# Altium project PROC154E3_SCH.PrjPcb (part 49 of 60)

## Sheet 52. POWER SUPPLY #3.SchDoc: POWER SUPPLY #3
size 513 x 386 mm; Project: PROC154E2(001)_SK_AM69; Issue: 1.0; RevCode: E3; Page Create Date: March  8, 1995; Variant Name: Core Design; Schematic Page Number: 52; Page Number: 52; Page Size: C; Comment: MISTRAL_TITLEBLK_CSIZE_1; Page Count: 62; Schematic Page Count: 62; Name: PROC154E2 001 SK AM69; DsnPath: C:\Users\danie\Downloads\sprr466c\PROC154E3_RP\PROC154E3_SCH.DSN; SchematicName: SCHEMATIC1; PageName: 52. POWER SUPPLY #3; PageSize: C; TopSchematic: True
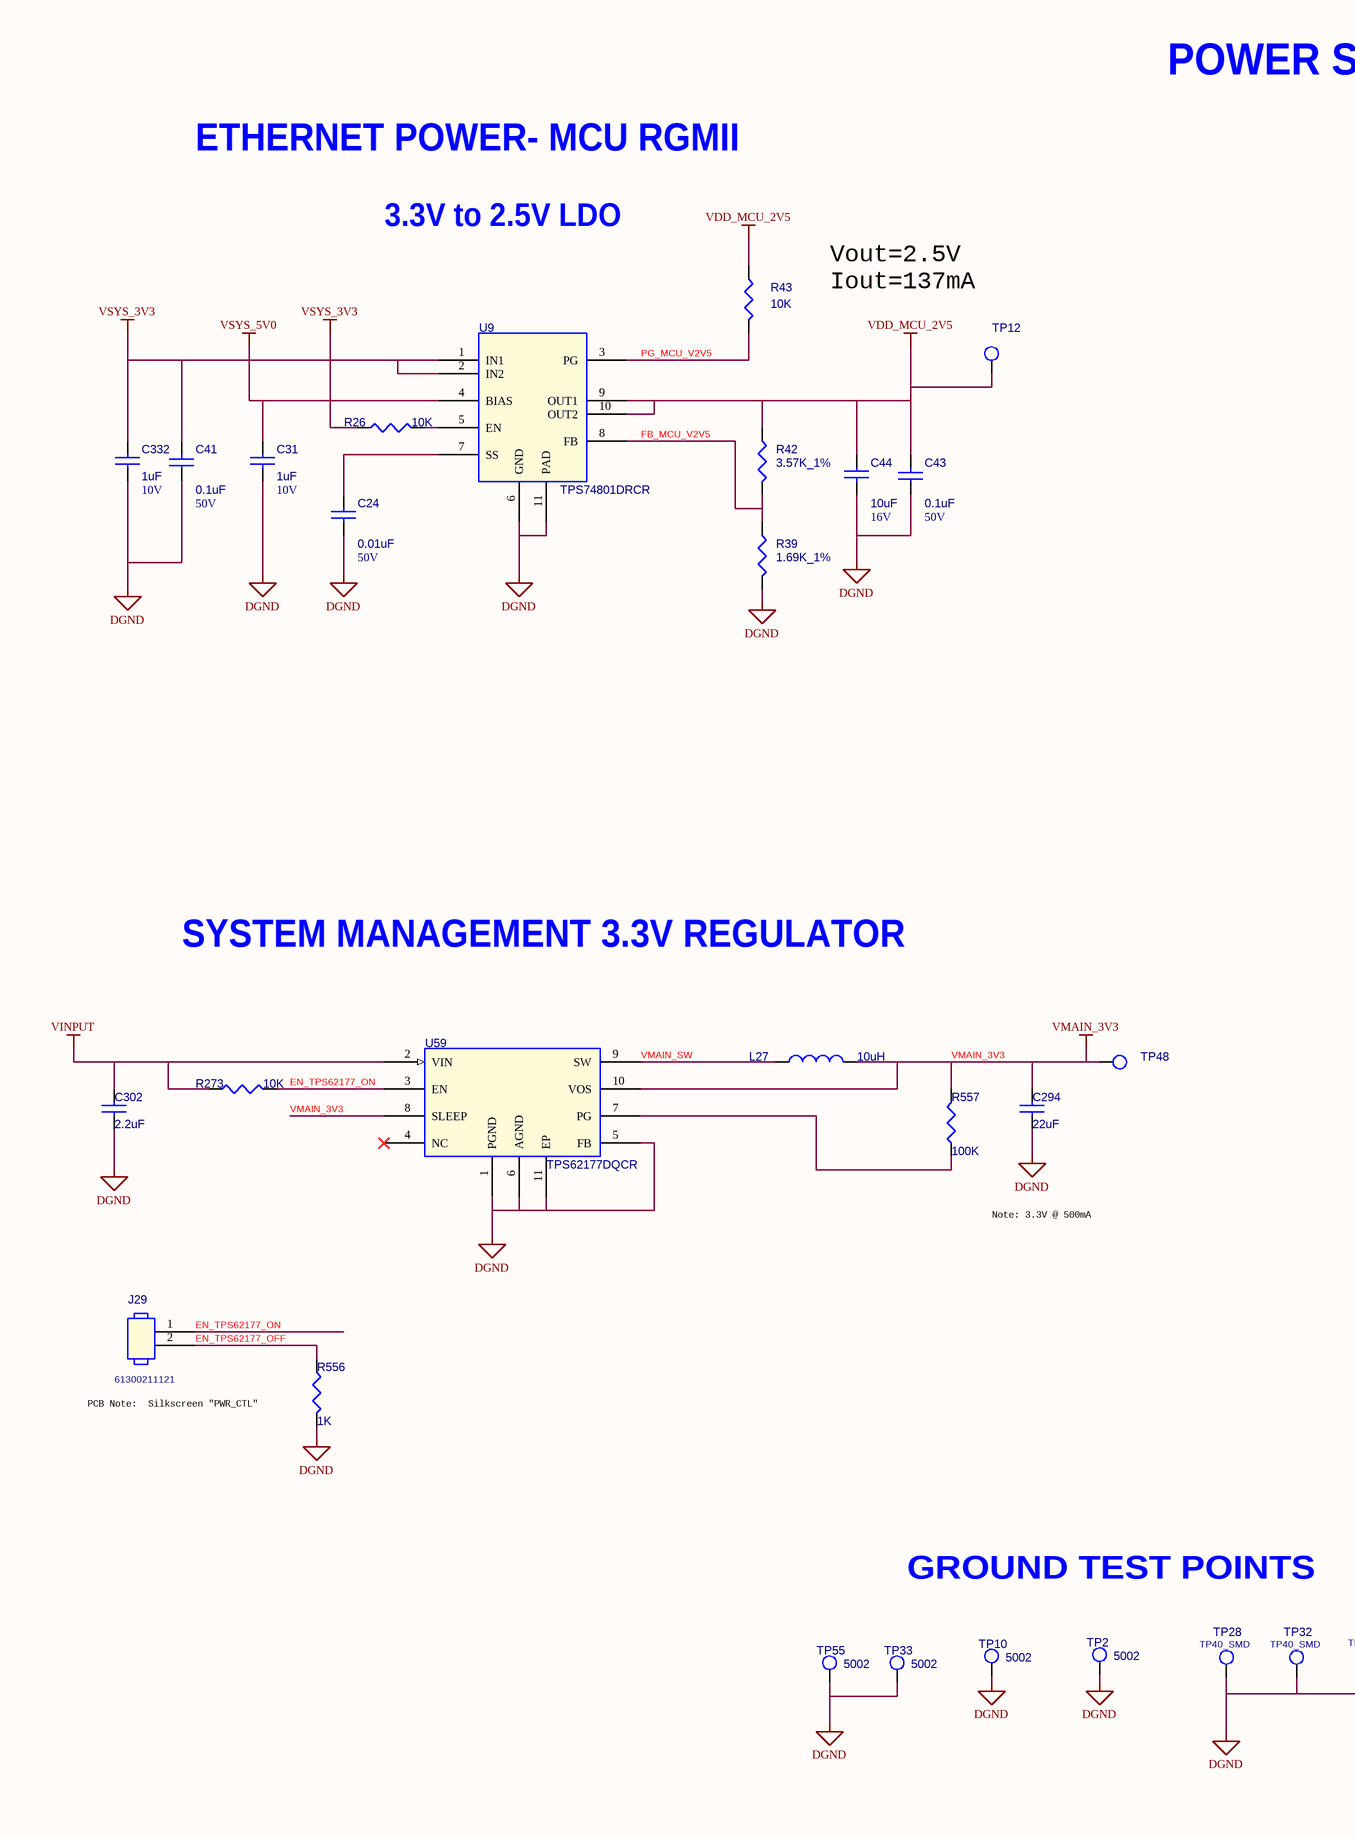
[diagram p87: 52. POWER SUPPLY #3.SchDoc, left]
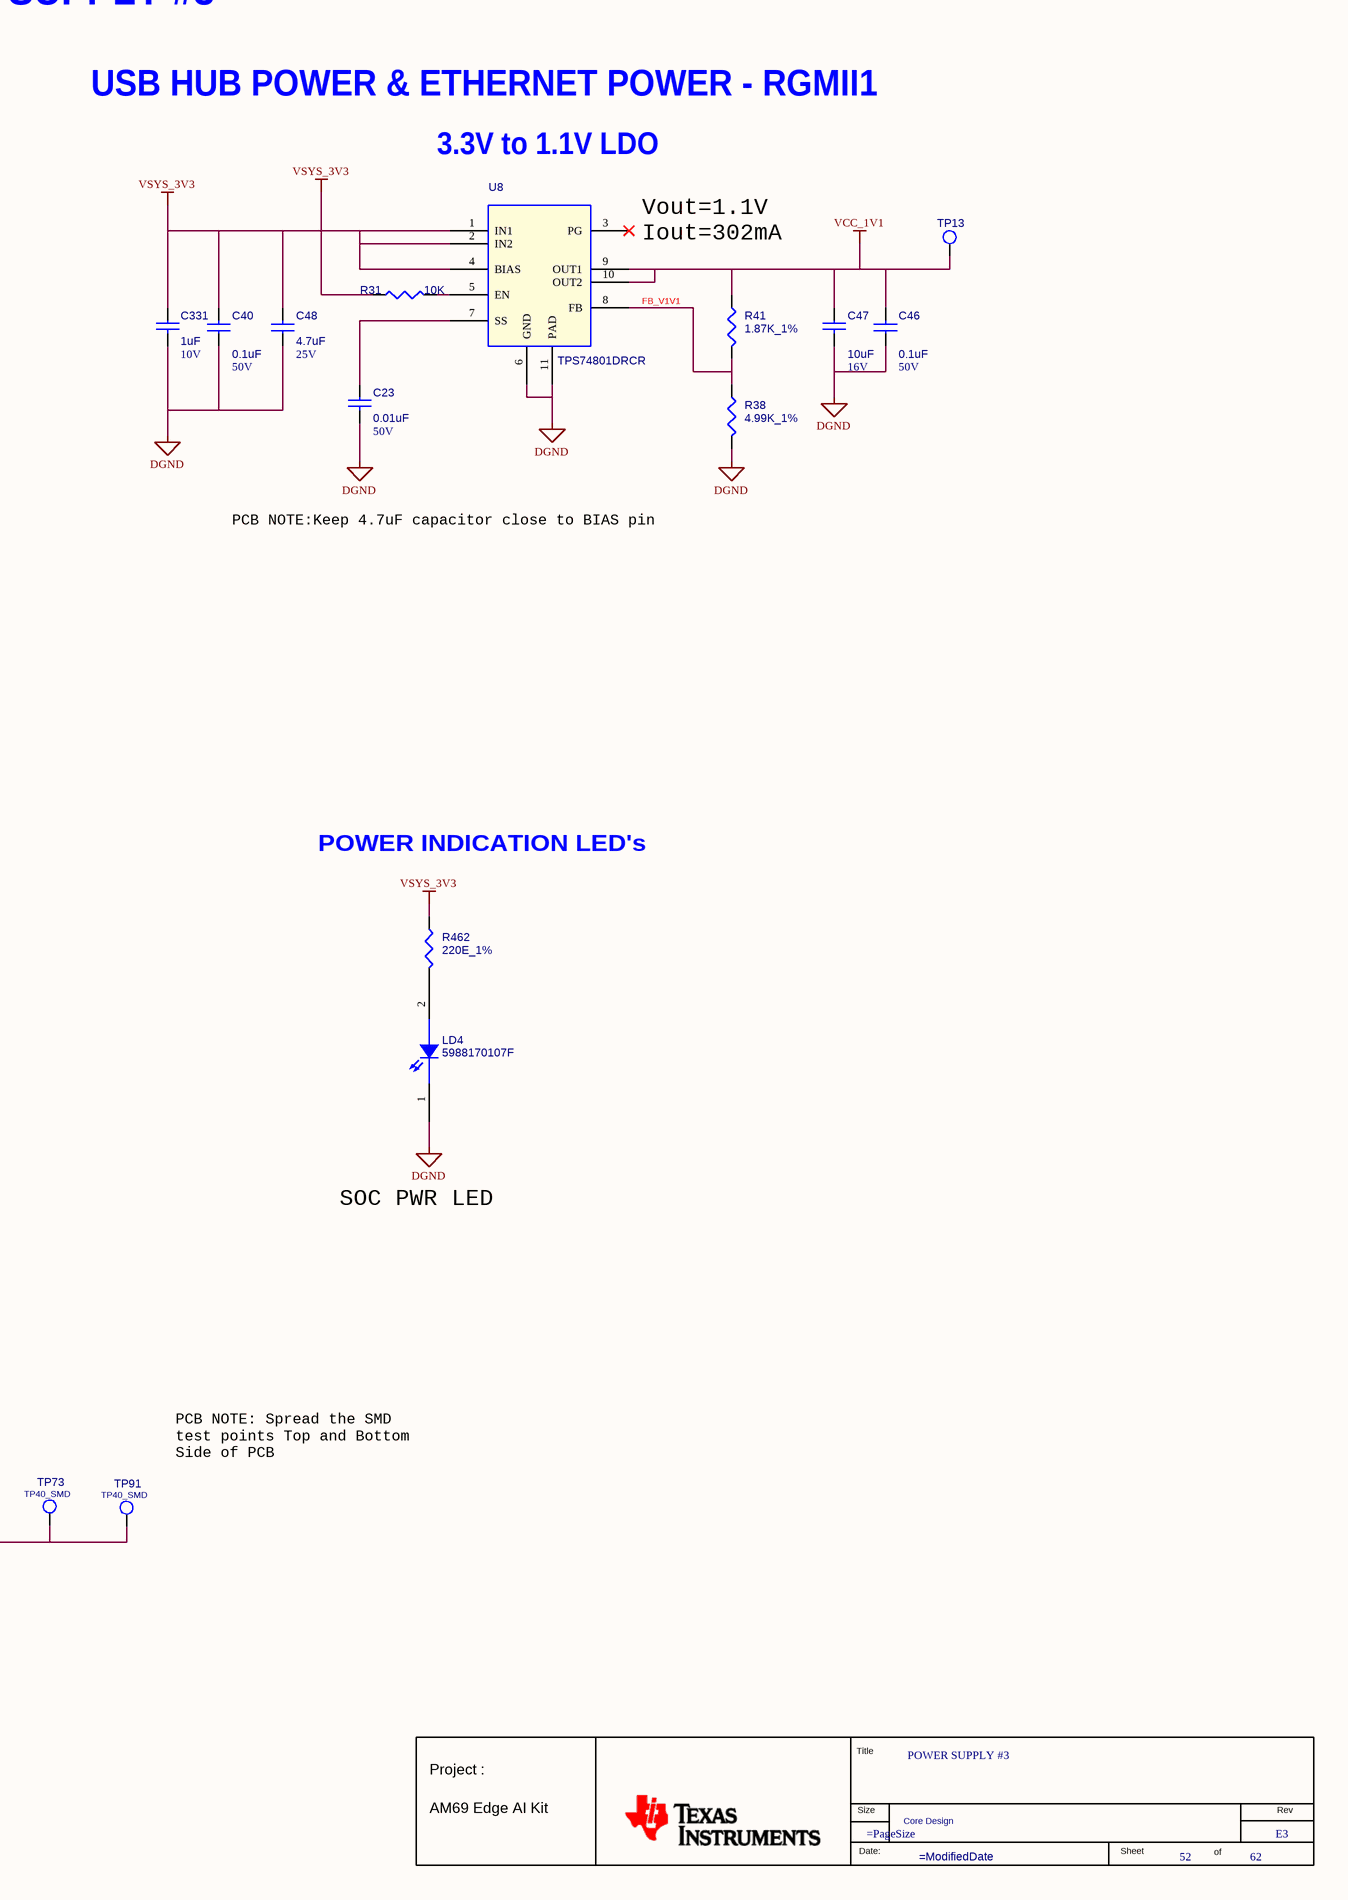
[diagram p88: 52. POWER SUPPLY #3.SchDoc, right]

### Parts
(Parts that share a designator on the sheet are numbered #1, #2 ... from top to bottom, then left to right.)
*#52  RevCode: E3  Title: POWER SUPPLY #3  Page Number: 52  Page Count: 62  Variant Name: Core Design  (hidden comment: MISTRAL_TITLEBLK_CSIZE_1)  (graphical)
C23  0.01uF  Voltage: 50V  [CAP0402_0-75]
C24  0.01uF  Voltage: 50V  [CAP0402_0-75]
C31  1uF  Voltage: 10V  [CAP0402_0-75]
C40  0.1uF  Voltage: 50V  [CAP0402_0-75]
C41  0.1uF  Voltage: 50V  [CAP0402_0-75]
C43  0.1uF  Voltage: 50V  [CAP0402_0-75]
C44  10uF  Voltage: 16V  [CAP0805_1-5]
C46  0.1uF  Voltage: 50V  [CAP0402_0-75]
C47  10uF  Voltage: 16V  [CAP0805_1-5]
C48  4.7uF  Voltage: 25V  [CAP0603_1]
C294  22uF  [CAP0805_1-5]
C302  2.2uF  [CAP0805_1-5]
C331  1uF  Voltage: 10V  [CAP0402_0-75]
C332  1uF  Voltage: 10V  [CAP0402_0-75]
J29  Mfr_part_number: 61300211121  [HDR_1X2_61300211121_S_T_8-6]  (hidden comment: HDR_1X2)
L27  10uH  [IND_1277AS-H_130X110_SMD_1-2]
LD4  5988170107F  [LED_0805_0-7]
R26  10K  [RES0402_0-5]
R31  10K  [RES0402_0-5]
R38  4.99K_1%  [RES0402_0-5]
R39  1.69K_1%  [RES0402_0-5]
R41  1.87K_1%  [RES0402_0-5]
R42  3.57K_1%  [RES0402_0-5]
R43  10K  [RES0402_0-5]
R273  10K  [RES0402_0-5]
R462  220E_1%  [RES0402_0-5]
R556  1K  [RES0201_0-5]
R557  100K  [RES0402_0-5]
TP2  5002  [TP_CIR67D40_TH_4-6]
TP10  5002  [TP_CIR67D40_TH_4-6]
TP12  TP40_SMD  [TP40_SMD]  (value not drawn)
TP13  THRU HOLE  [TP_40X65]  (value not drawn)
TP28  TP40_SMD  [TP40_SMD]
TP32  TP40_SMD  [TP40_SMD]
TP33  5002  [TP_CIR67D40_TH_4-6]
TP48  TP30_SMD  [TP30_SMD]  (value not drawn)
TP55  5002  [TP_CIR67D40_TH_4-6]
TP73  TP40_SMD  [TP40_SMD]
TP91  TP40_SMD  [TP40_SMD]
U8  TPS74801DRCR  [VSON10_TPS74801-Q1_120X120_1]
U9  TPS74801DRCR  [VSON10_TPS74801-Q1_120X120_1]
U59  TPS62177DQCR  [WSON10_19-68_80X120_0-8]

### Nets
DGND: C23.2 C24.2 C31.2 C40.1 C41.1 C43.1 C44.2 C46.1 C47.2 C48.1 C294.2 C302.2 C331.2 C332.2 LD4.1 R38.2 R39.2 R556.2 TP2.1(TP) TP10.1(TP) TP28.1(TP) TP32.1(TP) TP33.1(TP) TP55.1(TP) TP73.1(TP) TP91.1(TP) U8.6(GND) U8.11(PAD) U9.6(GND) U9.11(PAD) U59.1(PGND) U59.5(FB) U59.6(AGND) U59.11(EP)  [project net VDD_CPU_HCPS_GOSNS]
VCC_1V1: C46.2 C47.1 R41.1 TP13.1(TP) U8.9(OUT1) U8.10(OUT2)
VDD_MCU_2V5: C43.2 C44.1 R42.1 R43.1 TP12.1(TP) U9.9(OUT1) U9.10(OUT2)
VINPUT: C302.1 R273.1 U59.2(VIN)
VMAIN_3V3: C294.1 L27.2 R557.2 TP48.1(TP) U59.8(SLEEP) U59.10(VOS)
VSYS_3V3: C40.2 C41.2 C48.2 C331.1 C332.1 R26.1 R31.1 R462.1 U8.1(IN1) U8.2(IN2) U8.4(BIAS) U9.1(IN1) U9.2(IN2)  [project net V_3V3]
VSYS_5V0: C31.1 U9.4(BIAS)
EN_TPS62177_OFF: J29.2 R556.1
EN_TPS62177_ON: J29.1 R273.2 U59.3(EN)
FB_MCU_V2V5: R39.1 R42.2 U9.8(FB)
FB_V1V1: R38.1 R41.2 U8.8(FB)
PG_MCU_V2V5: R43.2 U9.3(PG)
VMAIN_SW: L27.1 U59.9(SW)
NetC23_1: C23.1 U8.7(SS)
NetC24_1: C24.1 U9.7(SS)
NetLD4_2: LD4.2 R462.2
NetR26_2: R26.2 U9.5(EN)
NetR31_2: R31.2 U8.5(EN)
NetR557_1: R557.1 U59.7(PG)

Not connected (* = marked no-connect by the designer): U8 3(PG)*; U59 4(NC)*

### Notes on the sheet
- POWER SUPPLY #3
- ETHERNET POWER- MCU RGMII
- USB HUB POWER & ETHERNET POWER - RGMII1
- 3.3V to 2.5V LDO
- Vout=2.5V
  Iout=137mA
- 3.3V to 1.1V LDO
- Vout=1.1V
  Iout=302mA
- PCB NOTE:Keep 4.7uF capacitor close to BIAS pin
- SYSTEM MANAGEMENT 3.3V REGULATOR
- POWER INDICATION LED's
- Note: 3.3V @ 500mA
- SOC PWR LED
- PCB Note:  Silkscreen "PWR_CTL"
- GROUND TEST POINTS
- PCB NOTE: Spread the SMD
  test points Top and Bottom
  Side of PCB
- (in symbol MISTRAL_TITLEBLK_CSIZE_1) Title; Project :; Size; Rev; AM69 Edge AI Kit; Date:; Sheet; of

### Library data of the parts
*#52 = MISTRAL_TITLEBLK_CSIZE_1: as *#51 on sheet 51. POWER SUPPLY #2; Page Create Date: March  8, 1995; Page Size: =PageSize; Page Modify Date: =ModifiedDate; Schematic Page Count: 62; Schematic Page Number: 52
C23 = CAP_Dup1: CAP CERAMIC 0.01uF 50V 10% X7R 0402; Part Reference: C23; Mistral Part No: 120009030025-R; Mfr_name: MURATA; Mfr_part_number: GRM155R71H103KA88D; Part_type: CAPACITORS\CERAMIC; Direct Alternate_mfr_name: YAGEO AMERICA; Direct Alternate_mfr_part_number: CC0402KRX7R8BB103; Automotive Alternate_mfr_name: TDK; Automotive Alternate_mfr_part_number: CGA2B2X7R1E103K050BA; Project: G4_SVGA; Customs_HS_Code: 85322990; Custom_Duty: 15%; Wattage: NA; Value: 0.01uF; PCB Footprint: CAP0402_0-75; Library Ref: CAP; Tolerance: 10%; Package: 0402; Distributor_name: DIGIKEY; Distributor_part_number: 490-4516-1-ND; Height: 0.55MM; Crtd /date: MANIRAJA/280319; Chkd/date: MANIRAJA/280319; Footprint Ref: CAP0402_0-75; Weight: 0.65mg; Temperature: -55°C+125°C; Datasheet: Y:\MIS_DATABASE\DATASHEETS\CAPACITORS\GRM155R71H103KA88D.PDF; MECHANICAL 3D STEP FILE: CAP0402_0-75; Library Path: Y:\MIS_DATABASE\Library\ALTIUM_TOOL\SCHEMATICS_PARTS\MS_DISCRETE_Library.schlib; Footprint Path: Y:\MIS_DATABASE\Library\ALTIUM_TOOL\PCB_FOOTPRINTS\Altium_Footprint_Lib.PcbLib; Manufacturer: MURATA
C24 = CAP_Dup1: CAP CERAMIC 0.01uF 50V 10% X7R 0402; Part Reference: C24; Part_type: CAPACITORS\CERAMIC; Mfr_part_number: GRM155R71H103KA88D; Mfr_name: MURATA; Mistral Part No: 120009030025-R; Direct Alternate_mfr_name: YAGEO AMERICA; Direct Alternate_mfr_part_number: CC0402KRX7R8BB103; Automotive Alternate_mfr_name: TDK; Automotive Alternate_mfr_part_number: CGA2B2X7R1E103K050BA; Custom_Duty: 15%; Customs_HS_Code: 85322990; Project: G4_SVGA; Wattage: NA; Value: 0.01uF; Chkd/date: MANIRAJA/280319; Crtd /date: MANIRAJA/280319; Height: 0.55MM; Distributor_part_number: 490-4516-1-ND; Distributor_name: DIGIKEY; Package: 0402; Tolerance: 10%; Library Ref: CAP; Footprint Ref: CAP0402_0-75; Weight: 0.65mg; Temperature: -55°C+125°C; Datasheet: Y:\MIS_DATABASE\DATASHEETS\CAPACITORS\GRM155R71H103KA88D.PDF; MECHANICAL 3D STEP FILE: CAP0402_0-75; Library Path: Y:\MIS_DATABASE\Library\ALTIUM_TOOL\SCHEMATICS_PARTS\MS_DISCRETE_Library.schlib; Footprint Path: Y:\MIS_DATABASE\Library\ALTIUM_TOOL\PCB_FOOTPRINTS\Altium_Footprint_Lib.PcbLib; Manufacturer: MURATA; PCB Footprint: CAP0402_0-75
C31 = CAP_Dup1: CAP CERAMIC 1uF 10V 10% X7S AUTO 0402; Part Reference: C31; Automotive Alternate_mfr_part_number: EMK105BJ105KVHF; Automotive Alternate_mfr_name: TAIYO YUDEN; Direct Alternate_mfr_part_number: CC0402KRX5R7BB105; Direct Alternate_mfr_name: YAGEO AMERICA; Mistral Part No: 120018090021-R; Mfr_name: MURATA; Mfr_part_number: GCM155C71A105KE38D; Part_type: CAPACITORS\CERAMIC; Manufacturer: TDK CORPORATION; Project: SMART-M_SCRIPTALK_PB; Wattage: NA; Customs_HS_Code: 85322990; Custom_Duty: 15%; Value: 1uF; Tolerance: 10%; Package: 0402; Distributor_name: DIGIKEY; Distributor_part_number: 490-13409-1-ND; Height: 0.70MM; Weight: 6mg; Temperature: -55°C+125°C; Datasheet: Y:\MIS_DATABASE\DATASHEETS\CAPACITORS\MURATA-GCM-SER.PDF; Crtd /date: ALVY/100918; Chkd/date: MANIRAJA/100918; Library Ref: CAP; MECHANICAL 3D STEP FILE: CAP0402_0-75; Footprint Ref: CAP0402_0-75; Library Path: Y:\MIS_DATABASE\Library\ALTIUM_TOOL\SCHEMATICS_PARTS\MS_DISCRETE_Library.schlib; Footprint Path: Y:\MIS_DATABASE\Library\ALTIUM_TOOL\PCB_FOOTPRINTS\Altium_Footprint_Lib.PcbLib; PCB Footprint: CAP0402_0-75
C40 = CAP_Dup1: CAP CERAMIC 0.1uF 50V 10% X7R 0402; Part Reference: C40; Mistral Part No: 120011100014-R; Mfr_name: MURATA; Mfr_part_number: GRM155R71H104KE14D; Part_type: CAPACITORS\CERAMIC; Direct Alternate_mfr_name: TDK; Direct Alternate_mfr_part_number: C1005X7R1H104K050BE; Automotive Alternate_mfr_part_number: CGA2B3X7R1H104K050BB; Project: J7_CP; Wattage: NA; Customs_HS_Code: 85322990; Custom_Duty: 15%; Value: 0.1uF; PCB Footprint: CAP0402_0-75; Footprint Ref: CAP0402_0-75; Library Ref: CAP; Tolerance: 10%; Package: 0402; Distributor_name: DIGIKEY; Distributor_part_number: 490-10700-1-ND; Height: 0.55MM; Weight: 3.1mg; Temperature: -55°C+125°C; Datasheet: Y:\MIS_DATABASE\DATASHEETS\CAPACITORS\GRM155R71H104KE14.PDF; Crtd /date: ALVY/211020; Chkd/date: MANIRAJA/261020; MECHANICAL 3D STEP FILE: CAP0402_0-75; Library Path: Y:\MIS_DATABASE\Library\ALTIUM_TOOL\SCHEMATICS_PARTS\MS_DISCRETE_Library.schlib; Footprint Path: Y:\MIS_DATABASE\Library\ALTIUM_TOOL\PCB_FOOTPRINTS\Altium_Footprint_Lib.PcbLib; Automotive Alternate_mfr_name: TDK; Manufacturer: MURATA
C41 = CAP_Dup1: CAP CERAMIC 0.1uF 50V 10% X7R 0402; Part Reference: C41; Automotive Alternate_mfr_part_number: CGA2B3X7R1H104K050BB; Automotive Alternate_mfr_name: TDK; Direct Alternate_mfr_part_number: C1005X7R1H104K050BE; Part_type: CAPACITORS\CERAMIC; Mfr_part_number: GRM155R71H104KE14D; Mfr_name: MURATA; Mistral Part No: 120011100014-R; Custom_Duty: 15%; Customs_HS_Code: 85322990; Wattage: NA; Project: J7_CP; Value: 0.1uF; Direct Alternate_mfr_name: TDK; Footprint Path: Y:\MIS_DATABASE\Library\ALTIUM_TOOL\PCB_FOOTPRINTS\Altium_Footprint_Lib.PcbLib; Library Path: Y:\MIS_DATABASE\Library\ALTIUM_TOOL\SCHEMATICS_PARTS\MS_DISCRETE_Library.schlib; MECHANICAL 3D STEP FILE: CAP0402_0-75; Chkd/date: MANIRAJA/261020; Crtd /date: ALVY/211020; Datasheet: Y:\MIS_DATABASE\DATASHEETS\CAPACITORS\GRM155R71H104KE14.PDF; Temperature: -55°C+125°C; Weight: 3.1mg; Height: 0.55MM; Distributor_part_number: 490-10700-1-ND; Distributor_name: DIGIKEY; Package: 0402; Tolerance: 10%; Library Ref: CAP; Footprint Ref: CAP0402_0-75; Manufacturer: MURATA; PCB Footprint: CAP0402_0-75
C43 = CAP_Dup1: CAP CERAMIC 0.1uF 50V 10% X7R 0402; Part Reference: C43; Part_type: CAPACITORS\CERAMIC; Mfr_part_number: GRM155R71H104KE14D; Mfr_name: MURATA; Mistral Part No: 120011100014-R; Direct Alternate_mfr_name: TDK; Direct Alternate_mfr_part_number: C1005X7R1H104K050BE; Automotive Alternate_mfr_part_number: CGA2B3X7R1H104K050BB; Custom_Duty: 15%; Customs_HS_Code: 85322990; Wattage: NA; Project: J7_CP; Value: 0.1uF; Footprint Path: Y:\MIS_DATABASE\Library\ALTIUM_TOOL\PCB_FOOTPRINTS\Altium_Footprint_Lib.PcbLib; Library Path: Y:\MIS_DATABASE\Library\ALTIUM_TOOL\SCHEMATICS_PARTS\MS_DISCRETE_Library.schlib; MECHANICAL 3D STEP FILE: CAP0402_0-75; Chkd/date: MANIRAJA/261020; Crtd /date: ALVY/211020; Datasheet: Y:\MIS_DATABASE\DATASHEETS\CAPACITORS\GRM155R71H104KE14.PDF; Temperature: -55°C+125°C; Weight: 3.1mg; Height: 0.55MM; Distributor_part_number: 490-10700-1-ND; Distributor_name: DIGIKEY; Package: 0402; Tolerance: 10%; Library Ref: CAP; Footprint Ref: CAP0402_0-75; Automotive Alternate_mfr_name: TDK; Manufacturer: MURATA; PCB Footprint: CAP0402_0-75
C44 = CAP_Dup1: CAP CERAMIC 10uF 16V 10% X5R 0805; Part Reference: C44; Part_type: CAPACITORS\CERAMIC; Mfr_part_number: GRM21BR61C106KE15L; Mfr_name: MURATA; Mistral Part No: 120009030205-R; Direct Alternate_mfr_name: TDK; Direct Alternate_mfr_part_number: C2012X7S1C106K125AC; Automotive Alternate_mfr_part_number: CGA4J1X7S1C106K125AC; Custom_Duty: 15%; Customs_HS_Code: 85322990; Project: VOCERA; Wattage: NA; Value: 10uF; Chkd/date: SHREESHAIL/220506; Crtd /date: MAZHAR/150506; Datasheet: Y:\MIS_DATABASE\DATASHEETS\CAPACITORS\MURATA-GXX-SER_NOV17.PDF; Height: 1.35MM; Distributor_part_number: 490-3886-1-ND; Distributor_name: DIGIKEY; Package: 0805; Tolerance: 10%; Library Ref: CAP; Footprint Ref: CAP0805_1-5; Weight: 9.5mg; Temperature: -55°C+85°C; MECHANICAL 3D STEP FILE: CAP0805_1-5; Library Path: Y:\MIS_DATABASE\Library\ALTIUM_TOOL\SCHEMATICS_PARTS\MS_DISCRETE_Library.schlib; Footprint Path: Y:\MIS_DATABASE\Library\ALTIUM_TOOL\PCB_FOOTPRINTS\Altium_Footprint_Lib.PcbLib; Automotive Alternate_mfr_name: TDK; Manufacturer: MURATA; PCB Footprint: CAP0805_1-5
C46 = CAP_Dup1: CAP CERAMIC 0.1uF 50V 10% X7R 0402; Part Reference: C46; Automotive Alternate_mfr_part_number: CGA2B3X7R1H104K050BB; Automotive Alternate_mfr_name: TDK; Direct Alternate_mfr_part_number: C1005X7R1H104K050BE; Mistral Part No: 120011100014-R; Mfr_name: MURATA; Mfr_part_number: GRM155R71H104KE14D; Part_type: CAPACITORS\CERAMIC; Project: J7_CP; Wattage: NA; Customs_HS_Code: 85322990; Custom_Duty: 15%; Value: 0.1uF; PCB Footprint: CAP0402_0-75; Direct Alternate_mfr_name: TDK; Footprint Ref: CAP0402_0-75; Library Ref: CAP; Tolerance: 10%; Package: 0402; Distributor_name: DIGIKEY; Distributor_part_number: 490-10700-1-ND; Height: 0.55MM; Weight: 3.1mg; Temperature: -55°C+125°C; Datasheet: Y:\MIS_DATABASE\DATASHEETS\CAPACITORS\GRM155R71H104KE14.PDF; Crtd /date: ALVY/211020; Chkd/date: MANIRAJA/261020; MECHANICAL 3D STEP FILE: CAP0402_0-75; Library Path: Y:\MIS_DATABASE\Library\ALTIUM_TOOL\SCHEMATICS_PARTS\MS_DISCRETE_Library.schlib; Footprint Path: Y:\MIS_DATABASE\Library\ALTIUM_TOOL\PCB_FOOTPRINTS\Altium_Footprint_Lib.PcbLib; Manufacturer: MURATA
C47 = CAP_Dup1: CAP CERAMIC 10uF 16V 10% X5R 0805; Part Reference: C47; Automotive Alternate_mfr_part_number: CGA4J1X7S1C106K125AC; Automotive Alternate_mfr_name: TDK; Direct Alternate_mfr_part_number: C2012X7S1C106K125AC; Mistral Part No: 120009030205-R; Mfr_name: MURATA; Mfr_part_number: GRM21BR61C106KE15L; Part_type: CAPACITORS\CERAMIC; Wattage: NA; Project: VOCERA; Customs_HS_Code: 85322990; Custom_Duty: 15%; Value: 10uF; PCB Footprint: CAP0805_1-5; Direct Alternate_mfr_name: TDK; Footprint Path: Y:\MIS_DATABASE\Library\ALTIUM_TOOL\PCB_FOOTPRINTS\Altium_Footprint_Lib.PcbLib; Library Path: Y:\MIS_DATABASE\Library\ALTIUM_TOOL\SCHEMATICS_PARTS\MS_DISCRETE_Library.schlib; MECHANICAL 3D STEP FILE: CAP0805_1-5; Temperature: -55°C+85°C; Weight: 9.5mg; Footprint Ref: CAP0805_1-5; Library Ref: CAP; Tolerance: 10%; Package: 0805; Distributor_name: DIGIKEY; Distributor_part_number: 490-3886-1-ND; Height: 1.35MM; Datasheet: Y:\MIS_DATABASE\DATASHEETS\CAPACITORS\MURATA-GXX-SER_NOV17.PDF; Crtd /date: MAZHAR/150506; Chkd/date: SHREESHAIL/220506; Manufacturer: MURATA
C48 = CAP_Dup1: CAP CERAMIC 4.7uF 25V 10% X6S 0603; Part Reference: C48; Mistral Part No: 120018100056-R; Mfr_name: MURATA; Mfr_part_number: GRM188C81E475KE11D; Part_type: CAPACITORS\CERAMIC; Direct Alternate_mfr_part_number: GRM188C81E475ME11D; Project: TI_J7ES_EVM_CP; Wattage: NA; Customs_HS_Code: 85322990; Custom_Duty: 15%; Value: 4.7uF; PCB Footprint: CAP0603_1; Footprint Ref: CAP0603_1; Tolerance: 10%; Package: 0603; Distributor_name: DIGIKEY; Distributor_part_number: 490-7199-1-ND; Library Ref: CAP; Height: 1.00MM; Weight: 6.3mg; Temperature: -55°C+105°C; Datasheet: Y:\MIS_DATABASE\DATASHEETS\CAPACITORS\GRM188C81E475KE11D.PDF; Crtd /date: ALVY/241018; Chkd/date: MANIRAJA/241018; MECHANICAL 3D STEP FILE: CAP0603_1; Library Path: Y:\MIS_DATABASE\Library\ALTIUM_TOOL\SCHEMATICS_PARTS\MS_DISCRETE_Library.schlib; Footprint Path: Y:\MIS_DATABASE\Library\ALTIUM_TOOL\PCB_FOOTPRINTS\Altium_Footprint_Lib.PcbLib; Direct Alternate_mfr_name: MURATA; Manufacturer: MURATA
C294 = CAP_Dup1: CAP CERAMIC 22uF 25V 20% X5R 0805; Part Reference: C294; Part_type: CAPACITORS\CERAMIC; Mfr_part_number: GRM21BR61E226ME44K; Mfr_name: MURATA; Mistral Part No: 120013120018-R; Custom_Duty: 15%; Customs_HS_Code: 85322990; Wattage: NA; Project: TI_J7SVB_PCIE_ADD-ON-CARD; Value: 22uF; PCB Footprint: CAP0805_1-5; MECHANICAL 3D STEP FILE: CAP0805_1-5; Chkd/date: MANIRAJA/110718; Crtd /date: ALVY/110718; Datasheet: Y:\MIS_DATABASE\DATASHEETS\CAPACITORS\GRM21BR61E226ME44K.PDF; Temperature: -55°C+85°C; Weight: 9.5mg; Height: 1.45MM; Library Ref: CAP; Distributor_part_number: 490-14661-1-ND; Distributor_name: DIGIKEY; Package: 0805; Voltage: 25V; Tolerance: 20%; Footprint Ref: CAP0805_1-5; Library Path: Y:\MIS_DATABASE\Library\ALTIUM_TOOL\SCHEMATICS_PARTS\MS_DISCRETE_Library.schlib; Footprint Path: Y:\MIS_DATABASE\Library\ALTIUM_TOOL\PCB_FOOTPRINTS\Altium_Footprint_Lib.PcbLib
C302 = CAP_Dup1: CAP CERAMIC 2.2uF 50V 10% X7R 0805; Part Reference: C302; Part_type: CAPACITORS\CERAMIC; Mfr_part_number: C2012X7R1H225K125AC; Mfr_name: TDK CORPORATION; Mistral Part No: 120011110028-R; Custom_Duty: 15%; Customs_HS_Code: 85322990; Wattage: NA; Project: NA10NG; Value: 2.2uF; PCB Footprint: CAP0805_1-5; Footprint Path: Y:\MIS_DATABASE\Library\ALTIUM_TOOL\PCB_FOOTPRINTS\Altium_Footprint_Lib.PcbLib; Library Path: Y:\MIS_DATABASE\Library\ALTIUM_TOOL\SCHEMATICS_PARTS\MS_DISCRETE_Library.schlib; MECHANICAL 3D STEP FILE: CAP0805_1-5; Chkd/date: VASANTHA/281216; Crtd /date: CHAITHANYA/281111; Datasheet: Y:\MIS_DATABASE\DATASHEETS\CAPACITORS\TDK_C-SER-JUL17.PDF; Temperature: -55°C+125°C; Weight: 5.5mg; Height: 1.45MM; Library Ref: CAP; Distributor_part_number: 445-5968-1-ND; Distributor_name: DIGIKEY; Package: 0805; Voltage: 50V; Tolerance: 10%; Footprint Ref: CAP0805_1-5
C331 = CAP_Dup1: CAP CERAMIC 1uF 10V 10% X7S AUTO 0402; Part Reference: C331; Part_type: CAPACITORS\CERAMIC; Mfr_part_number: GCM155C71A105KE38D; Mfr_name: MURATA; Mistral Part No: 120018090021-R; Direct Alternate_mfr_name: YAGEO AMERICA; Direct Alternate_mfr_part_number: CC0402KRX5R7BB105; Automotive Alternate_mfr_name: TAIYO YUDEN; Automotive Alternate_mfr_part_number: EMK105BJ105KVHF; Manufacturer: TDK CORPORATION; Custom_Duty: 15%; Customs_HS_Code: 85322990; Wattage: NA; Project: SMART-M_SCRIPTALK_PB; Value: 1uF; PCB Footprint: CAP0402_0-75; Footprint Path: Y:\MIS_DATABASE\Library\ALTIUM_TOOL\PCB_FOOTPRINTS\Altium_Footprint_Lib.PcbLib; Library Path: Y:\MIS_DATABASE\Library\ALTIUM_TOOL\SCHEMATICS_PARTS\MS_DISCRETE_Library.schlib; Footprint Ref: CAP0402_0-75; MECHANICAL 3D STEP FILE: CAP0402_0-75; Library Ref: CAP; Chkd/date: MANIRAJA/100918; Crtd /date: ALVY/100918; Datasheet: Y:\MIS_DATABASE\DATASHEETS\CAPACITORS\MURATA-GCM-SER.PDF; Temperature: -55°C+125°C; Weight: 6mg; Height: 0.70MM; Distributor_part_number: 490-13409-1-ND; Distributor_name: DIGIKEY; Package: 0402; Tolerance: 10%
C332 = CAP_Dup1: CAP CERAMIC 1uF 10V 10% X7S AUTO 0402; Part Reference: C332; Automotive Alternate_mfr_part_number: EMK105BJ105KVHF; Automotive Alternate_mfr_name: TAIYO YUDEN; Direct Alternate_mfr_part_number: CC0402KRX5R7BB105; Direct Alternate_mfr_name: YAGEO AMERICA; Mistral Part No: 120018090021-R; Mfr_name: MURATA; Mfr_part_number: GCM155C71A105KE38D; Part_type: CAPACITORS\CERAMIC; Manufacturer: TDK CORPORATION; Project: SMART-M_SCRIPTALK_PB; Wattage: NA; Customs_HS_Code: 85322990; Custom_Duty: 15%; Value: 1uF; Tolerance: 10%; Package: 0402; Distributor_name: DIGIKEY; Distributor_part_number: 490-13409-1-ND; Height: 0.70MM; Weight: 6mg; Temperature: -55°C+125°C; Datasheet: Y:\MIS_DATABASE\DATASHEETS\CAPACITORS\MURATA-GCM-SER.PDF; Crtd /date: ALVY/100918; Chkd/date: MANIRAJA/100918; Library Ref: CAP; MECHANICAL 3D STEP FILE: CAP0402_0-75; Footprint Ref: CAP0402_0-75; Library Path: Y:\MIS_DATABASE\Library\ALTIUM_TOOL\SCHEMATICS_PARTS\MS_DISCRETE_Library.schlib; Footprint Path: Y:\MIS_DATABASE\Library\ALTIUM_TOOL\PCB_FOOTPRINTS\Altium_Footprint_Lib.PcbLib; PCB Footprint: CAP0402_0-75
J29 = HEADER_2X1: CON HDR 1X2 2.54MM PITCH ST TH; Part Reference: J29; Part_type: CONNECTOR\HEADERS; Mfr_name: WURTH ELECTRONICS; Mistral Part No: 150018100003-R; Custom_Duty: 24%; Customs_HS_Code: 85369090; Wattage: NA; Project: ALPINE_EVM; Value: HDR_1X2; PCB Footprint: HDR_1X2_61300211121_S_T_8-6; Footprint Path: Y:\MIS_DATABASE\Library\ALTIUM_TOOL\PCB_FOOTPRINTS\Altium_Footprint_Lib.PcbLib; Library Path: Y:\MIS_DATABASE\Library\ALTIUM_TOOL\SCHEMATICS_PARTS\MS_CONNECTOR_Library.schlib; MECHANICAL 3D STEP FILE: HDR_1X2_61300211121_S_T_8-6; Chkd/date: MANIRAJA/031018; Crtd /date: ALVY/031018; Datasheet: Y:\MIS_DATABASE\DATASHEETS\CONNECTORS\6130XXX.PDF; Temperature: -40°C+105°C; Weight: 120mg; Height: 8.54MM; Library Ref: HEADER_2X1; Distributor_part_number: 732-5315-ND; Distributor_name: DIGIKEY; Package: THRU-HOLE; Voltage: NA; Tolerance: NA; Footprint Ref: HDR_1X2_61300211121_S_T_8-6
L27 = INDUCTOR: IND POWER 10uH 900mA 20% SMD; Part Reference: L27; Mistral Part No: 130021090022-R; Mfr_name: MURATA; Mfr_part_number: 1277AS-H-100M=P2; Project: TI_AM62x SKEVM_BRD; Voltage: NA; Customs_HS_Code: 85369090; Custom_Duty: 24%; Value: 10uH; PCB Footprint: IND_1277AS-H_130X110_SMD_1-2; Footprint Ref: IND_1277AS-H_130X110_SMD_1-2; Part_type: INDUCTOR; Tolerance: 20%; Wattage: NA; Package: SMD; Distributor_name: DIGIKEY; Distributor_part_number: 490-10589-1-ND; Library Ref: INDUCTOR; Height: 1.20MM; Weight: NA; Temperature: -40°C+85°C; Datasheet: Y:\MIS_DATABASE\DATASHEETS\DISCRETES\INDUCTORS\MURATA-1277AS-H.PDF; Crtd /date: ALVY/200921; Chkd/date: MANIRAJA/200921; MECHANICAL 3D STEP FILE: IND_1277AS-H_130X110_SMD_1-2; Library Path: Y:\MIS_DATABASE\Library\ALTIUM_TOOL\SCHEMATICS_PARTS\MS_DISCRETE_Library.schlib; Footprint Path: Y:\MIS_DATABASE\Library\ALTIUM_TOOL\PCB_FOOTPRINTS\Altium_Footprint_Lib.PcbLib
LD4 = LED_598-8170-107F: LED ALINGAP GREEN CLEAR 0805; Part Reference: LD4; Part_type: OPTO\LED; Mfr_name: DIALIGHT; Mistral Part No: 130014050065-R; Custom_Duty: 24%; Customs_HS_Code: 85437099; Wattage: NA; Project: AEGIS GP BETA2; Value: 5988170107F; Footprint Path: Y:\MIS_DATABASE\Library\ALTIUM_TOOL\PCB_FOOTPRINTS\Altium_Footprint_Lib.PcbLib; MECHANICAL 3D STEP FILE: LED_0805_0-7; Chkd/date: MANIRAJA/230817; Crtd /date: SARANYA/070514; Datasheet: Y:\MIS_DATABASE\DATASHEETS\DISCRETES\LEDS\598-SER.PDF; Temperature: -30°C+85°C; Weight: NA; Height: 0.70MM; Distributor_part_number: 350-2044-1-ND; Distributor_name: DIGIKEY; Package: 0805; Voltage: NA; Tolerance: NA; Mfr_part_number: 5988170107F; Library Ref: LED_598-8170-107F; Manufacturer: DIALIGHT; PCB Footprint: LED_0805_0-7
R26 = RESISTOR_Dup2: RES 10K 1/16W 5% 0402; Part Reference: R26; Mistral Part No: 110011060021-R; Mfr_name: YAGEO AMERICA; Mfr_part_number: RC0402JR-0710KL; Part_type: RESISTORS\FIXED; Project: HSE; Voltage: NA; Customs_HS_Code: 85332119; Custom_Duty: 15%; Value: 10K; Footprint Path: Y:\MIS_DATABASE\Library\ALTIUM_TOOL\PCB_FOOTPRINTS\Altium_Footprint_Lib.PcbLib; Library Path: Y:\MIS_DATABASE\Library\ALTIUM_TOOL\SCHEMATICS_PARTS\MS_DISCRETE_Library.schlib; Footprint Ref: RES0402_0-5; Library Ref: RESISTOR; Tolerance: 5%; Wattage: 1/16W; Package: 0402; Distributor_name: DIGIKEY; Distributor_part_number: 311-10KJRCT-ND; Height: 0.40MM; Weight: 0.65mg; Temperature: -55°C+155°C; Datasheet: Y:\MIS_DATABASE\DATASHEETS\RESISTORS\RCXXXXL-SER_MAR18.PDF; Crtd /date: MAZHAR/230805; Chkd/date: VASANTHA/061216; MECHANICAL 3D STEP FILE: RES0402_0-5; Manufacturer: YAGEO AMERICA; PCB Footprint: RES0402_0-5
R31 = RESISTOR_Dup2: RES 10K 1/16W 5% 0402; Part Reference: R31; Part_type: RESISTORS\FIXED; Mfr_part_number: RC0402JR-0710KL; Mfr_name: YAGEO AMERICA; Mistral Part No: 110011060021-R; Custom_Duty: 15%; Customs_HS_Code: 85332119; Voltage: NA; Project: HSE; Value: 10K; PCB Footprint: RES0402_0-5; MECHANICAL 3D STEP FILE: RES0402_0-5; Chkd/date: VASANTHA/061216; Crtd /date: MAZHAR/230805; Datasheet: Y:\MIS_DATABASE\DATASHEETS\RESISTORS\RCXXXXL-SER_MAR18.PDF; Temperature: -55°C+155°C; Weight: 0.65mg; Height: 0.40MM; Distributor_part_number: 311-10KJRCT-ND; Distributor_name: DIGIKEY; Package: 0402; Wattage: 1/16W; Tolerance: 5%; Library Ref: RESISTOR; Footprint Ref: RES0402_0-5; Library Path: Y:\MIS_DATABASE\Library\ALTIUM_TOOL\SCHEMATICS_PARTS\MS_DISCRETE_Library.schlib; Footprint Path: Y:\MIS_DATABASE\Library\ALTIUM_TOOL\PCB_FOOTPRINTS\Altium_Footprint_Lib.PcbLib; Manufacturer: YAGEO AMERICA
R38 = RESISTOR_Dup2: RES 4.99K 1/10W 1% 0402; Part Reference: R38; Mistral Part No: 110009030808-R; Mfr_name: PANASONIC-ECG; Mfr_part_number: ERJ-2RKF4991X; Part_type: RESISTORS\FIXED; Project: VOCERA; Voltage: NA; Customs_HS_Code: 85332119; Custom_Duty: 15%; Value: 4.99K_1%; PCB Footprint: RES0402_0-5; Footprint Ref: RES0402_0-5; Tolerance: 1%; Wattage: 1/10W; Package: 0402; Distributor_name: DIGIKEY; Distributor_part_number: P4.99KLCT-ND; Library Ref: RESISTOR; Height: 0.40MM; Weight: 0.8mg; Temperature: -55°C+155°C; Datasheet: Y:\MIS_DATABASE\DATASHEETS\RESISTORS\PAN-ERJSER_NOV17.PDF; Crtd /date: MAZHAR/150506; Chkd/date: VASANTHA/281216; MECHANICAL 3D STEP FILE: RES0402_0-5; Library Path: Y:\MIS_DATABASE\Library\ALTIUM_TOOL\SCHEMATICS_PARTS\MS_DISCRETE_Library.schlib; Footprint Path: Y:\MIS_DATABASE\Library\ALTIUM_TOOL\PCB_FOOTPRINTS\Altium_Footprint_Lib.PcbLib; Manufacturer: PANASONIC-ECG
R39 = RESISTOR_Dup2: RES 1.69K 1/10W 1% 0402; Part Reference: R39; Part_type: RESISTORS\FIXED; Mfr_part_number: ERJ-2RKF1691X; Mfr_name: PANASONIC-ECG; Mistral Part No: 110009030133-R; Custom_Duty: 15%; Customs_HS_Code: 85332119; Voltage: NA; Project: PMP-VIOMEDIA; Value: 1.69K_1%; Footprint Path: Y:\MIS_DATABASE\Library\ALTIUM_TOOL\PCB_FOOTPRINTS\Altium_Footprint_Lib.PcbLib; Library Path: Y:\MIS_DATABASE\Library\ALTIUM_TOOL\SCHEMATICS_PARTS\MS_DISCRETE_Library.schlib; MECHANICAL 3D STEP FILE: RES0402_0-5; Chkd/date: SHREESHAIL/121205; Crtd /date: MAZHAR/180705; Datasheet: Y:\MIS_DATABASE\DATASHEETS\RESISTORS\PAN-ERJSER_NOV17.PDF; Temperature: -55°C+155°C; Weight: 0.8mg; Height: 0.40MM; Library Ref: RESISTOR; Distributor_part_number: P1.69KLCT-ND; Distributor_name: DIGIKEY; Package: 0402; Wattage: 1/10W; Tolerance: 1%; Footprint Ref: RES0402_0-5; Manufacturer: PANASONIC-ECG; PCB Footprint: RES0402_0-5
R41 = RESISTOR_Dup2: RES 1.87K 1/10W 1% 0402; Part Reference: R41; Part_type: RESISTORS\FIXED; Mfr_part_number: ERJ-2RKF1871X; Mfr_name: PANASONIC-ECG; Mistral Part No: 110009030145-R; Custom_Duty: 15%; Customs_HS_Code: 85332119; Voltage: NA; Project: KHAN_HSST; Value: 1.87K_1%; PCB Footprint: RES0402_0-5; Footprint Path: Y:\MIS_DATABASE\Library\ALTIUM_TOOL\PCB_FOOTPRINTS\Altium_Footprint_Lib.PcbLib; Library Path: Y:\MIS_DATABASE\Library\ALTIUM_TOOL\SCHEMATICS_PARTS\MS_DISCRETE_Library.schlib; MECHANICAL 3D STEP FILE: RES0402_0-5; Chkd/date: MAZHAR/151208; Crtd /date: USMAN/251108; Datasheet: Y:\MIS_DATABASE\DATASHEETS\RESISTORS\PAN-ERJSER_NOV17.PDF; Temperature: -55°C+155°C; Weight: 0.8mg; Height: 0.40MM; Library Ref: RESISTOR; Distributor_part_number: P1.87KLCT-ND; Distributor_name: DIGIKEY; Package: 0402; Wattage: 1/10W; Tolerance: 1%; Footprint Ref: RES0402_0-5; Manufacturer: PANASONIC-ECG
R42 = RESISTOR_Dup2: RES 3.57K 1/16W 1% 0402; Part Reference: R42; Mistral Part No: 110009070012-R; Mfr_name: VISHAY; Mfr_part_number: CRCW04023K57FKED; Part_type: RESISTORS\FIXED; Project: VMEFMCD; Voltage: NA; Customs_HS_Code: 85332119; Custom_Duty: 15%; Value: 3.57K_1%; Tolerance: 1%; Wattage: 1/16W; Package: 0402; Distributor_name: DIGIKEY; Distributor_part_number: 541-3.57KLCT-ND; Library Ref: RESISTOR; Height: 0.40MM; Weight: 0.65mg; Temperature: -55°C+155°C; Datasheet: Y:\MIS_DATABASE\DATASHEETS\RESISTORS\CRCW0603.PDF; Crtd /date: USMAN/300709; Chkd/date: VASANTHA/281216; MECHANICAL 3D STEP FILE: RES0402_0-5; Footprint Ref: RES0402_0-5; Library Path: Y:\MIS_DATABASE\Library\ALTIUM_TOOL\SCHEMATICS_PARTS\MS_DISCRETE_Library.schlib; Footprint Path: Y:\MIS_DATABASE\Library\ALTIUM_TOOL\PCB_FOOTPRINTS\Altium_Footprint_Lib.PcbLib; Manufacturer: VISHAY; PCB Footprint: RES0402_0-5
R43 = RESISTOR_Dup2: RES 10K 1/16W 5% 0402; Part Reference: R43; Mistral Part No: 110011060021-R; Mfr_name: YAGEO AMERICA; Mfr_part_number: RC0402JR-0710KL; Part_type: RESISTORS\FIXED; Project: HSE; Voltage: NA; Customs_HS_Code: 85332119; Custom_Duty: 15%; Value: 10K; Footprint Path: Y:\MIS_DATABASE\Library\ALTIUM_TOOL\PCB_FOOTPRINTS\Altium_Footprint_Lib.PcbLib; Library Path: Y:\MIS_DATABASE\Library\ALTIUM_TOOL\SCHEMATICS_PARTS\MS_DISCRETE_Library.schlib; Footprint Ref: RES0402_0-5; Library Ref: RESISTOR; Tolerance: 5%; Wattage: 1/16W; Package: 0402; Distributor_name: DIGIKEY; Distributor_part_number: 311-10KJRCT-ND; Height: 0.40MM; Weight: 0.65mg; Temperature: -55°C+155°C; Datasheet: Y:\MIS_DATABASE\DATASHEETS\RESISTORS\RCXXXXL-SER_MAR18.PDF; Crtd /date: MAZHAR/230805; Chkd/date: VASANTHA/061216; MECHANICAL 3D STEP FILE: RES0402_0-5; Manufacturer: YAGEO AMERICA; PCB Footprint: RES0402_0-5
R273 = RESISTOR_Dup2: RES 10K 1/16W 5% 0402; Part Reference: R273; Manufacturer: YAGEO AMERICA; Part_type: RESISTORS\FIXED; Mfr_part_number: RC0402JR-0710KL; Mistral Part No: 110011060021-R; Custom_Duty: 15%; Customs_HS_Code: 85332119; Voltage: NA; Project: HSE; Value: 10K; PCB Footprint: RES0402_0-5; MECHANICAL 3D STEP FILE: RES0402_0-5; Chkd/date: VASANTHA/061216; Crtd /date: MAZHAR/230805; Datasheet: Y:\MIS_DATABASE\DATASHEETS\RESISTORS\RCXXXXL-SER_MAR18.PDF; Temperature: -55°C+155°C; Weight: 0.65mg; Height: 0.40MM; Distributor_part_number: 311-10KJRCT-ND; Distributor_name: DIGIKEY; Package: 0402; Wattage: 1/16W; Tolerance: 5%; Mfr_name: YAGEO AMERICA; Library Ref: RESISTOR; Footprint Ref: RES0402_0-5; Library Path: Y:\MIS_DATABASE\Library\ALTIUM_TOOL\SCHEMATICS_PARTS\MS_DISCRETE_Library.schlib; Footprint Path: Y:\MIS_DATABASE\Library\ALTIUM_TOOL\PCB_FOOTPRINTS\Altium_Footprint_Lib.PcbLib
R462 = RESISTOR_Dup2: RES 220E 1/16W 1% 0402; Part Reference: R462; Part_type: RESISTORS\FIXED; Mfr_part_number: RC0402FR-07220RL; Mfr_name: YAGEO AMERICA; Mistral Part No: 110019040169-R; Voltage: NA; Custom_Duty: 15%; Customs_HS_Code: 85332119; Project: TI_SVB_MAXWELL_DUT; Value: 220E_1%; MECHANICAL 3D STEP FILE: RES0402_0-5; Temperature: -55°C+155°C; Weight: 0.65mg; Chkd/date: MANIRAJA/130917; Crtd /date: MANIRAJA/130917; Datasheet: Y:\MIS_DATABASE\DATASHEETS\RESISTORS\RCXXXXL-SER_MAR18.PDF; Height: 0.40MM; Distributor_part_number: 311-220LRCT-ND; Distributor_name: DIGIKEY; Package: 0402; Wattage: 1/16W; Tolerance: 1%; Library Ref: RESISTOR; Footprint Ref: RES0402_0-5; Library Path: Y:\MIS_DATABASE\Library\ALTIUM_TOOL\SCHEMATICS_PARTS\MS_DISCRETE_Library.schlib; Footprint Path: Y:\MIS_DATABASE\Library\ALTIUM_TOOL\PCB_FOOTPRINTS\Altium_Footprint_Lib.PcbLib; Manufacturer: YAGEO AMERICA; PCB Footprint: RES0402_0-5
R556 = RESISTOR_Dup1: RES 1K 1/20W 5% 0201; Part Reference: R556; Mistral Part No: 110009030395-R; Mfr_name: YAGEO AMERICA; Mfr_part_number: RC0201JR-071KL; Part_type: RESISTORS\FIXED; Project: GOLDEN-I LITE; Voltage: NA; Customs_HS_Code: 85332119; Custom_Duty: 15%; Value: 1K; PCB Footprint: RES0201_0-5; Tolerance: 5%; Wattage: 1/20W; Package: 0201; Distributor_name: DIGIKEY; Distributor_part_number: 311-1KNCT-ND; Height: 0.26MM; Weight: 0.17mg; Temperature: -55°C+125°C; Datasheet: Y:\MIS_DATABASE\DATASHEETS\RESISTORS\RCXXXXL-SER_MAR18.PDF; Crtd /date: MANIRAJA/050517; Chkd/date: MANIRAJA/050517; Library Ref: RESISTOR; Footprint Ref: RES0201_0-5; MECHANICAL 3D STEP FILE: RES0201_0-5; Library Path: Y:\MIS_DATABASE\Library\ALTIUM_TOOL\SCHEMATICS_PARTS\MS_DISCRETE_Library.schlib; Footprint Path: Y:\MIS_DATABASE\Library\ALTIUM_TOOL\PCB_FOOTPRINTS\Altium_Footprint_Lib.PcbLib
R557 = RESISTOR_Dup2: RES 100K 1/10W 5% 0402; Part Reference: R557; Mistral Part No: 110009030177-R; Mfr_name: PANASONIC-ECG; Mfr_part_number: ERJ-2GEJ104X; Part_type: RESISTORS\FIXED; Project: RED EYE; Voltage: NA; Customs_HS_Code: 85332119; Custom_Duty: 15%; Value: 100K; PCB Footprint: RES0402_0-5; Tolerance: 5%; Wattage: 1/10W; Package: 0402; Distributor_name: DIGIKEY; Distributor_part_number: P100KJCT-ND; Height: 0.40MM; Weight: 0.8mg; Temperature: -55°C+155°C; Datasheet: Y:\MIS_DATABASE\DATASHEETS\RESISTORS\PAN-ERJSER_NOV17.PDF; Crtd /date: GEETHA/190406; Chkd/date: VASANTHA/291216; Library Ref: RESISTOR; Footprint Ref: RES0402_0-5; MECHANICAL 3D STEP FILE: RES0402_0-5; Library Path: Y:\MIS_DATABASE\Library\ALTIUM_TOOL\SCHEMATICS_PARTS\MS_DISCRETE_Library.schlib; Footprint Path: Y:\MIS_DATABASE\Library\ALTIUM_TOOL\PCB_FOOTPRINTS\Altium_Footprint_Lib.PcbLib
TP2 = TESTPOINT_Dup1: ACCESSORIE PC TEST POINT; Part Reference: TP2; Mistral Part No: 160016120008-R; Mfr_name: KEYSTONE; Part_type: ACCESSORIES; Project: EPOS_EVM; Tolerance: NA; Value: 5002; Mfr_part_number: 5002; Voltage: NA; Wattage: NA; Package: NA; Distributor_name: DIGIKEY; Distributor_part_number: 36-5002-ND; Library Ref: TESTPOINT; Height: 4.57MM; Weight: NA; Temperature: NA; Datasheet: Y:\MIS_DATABASE\DATASHEETS\MISC\ACCESSORIES\5002.PDF; Crtd /date: MANIRAJA/121216; Chkd/date: VASANTHA/121216; MECHANICAL 3D STEP FILE: TP_CIR67D40_TH_4-6; Footprint Ref: TP_CIR67D40_TH_4-6; Customs_HS_Code: NA; Custom_Duty: NA; Library Path: Y:\MIS_DATABASE\Library\ALTIUM_TOOL\SCHEMATICS_PARTS\MS_DISCRETE_Library.schlib; Footprint Path: Y:\MIS_DATABASE\Library\ALTIUM_TOOL\PCB_FOOTPRINTS\Altium_Footprint_Lib.PcbLib; Manufacturer: KEYSTONE; PCB Footprint: TP_CIR67D40_TH_4-6
TP10 = TESTPOINT_Dup1: ACCESSORIE PC TEST POINT; Part Reference: TP10; Mistral Part No: 160016120008-R; Mfr_name: KEYSTONE; Part_type: ACCESSORIES; Project: EPOS_EVM; Tolerance: NA; Value: 5002; Mfr_part_number: 5002; Voltage: NA; Wattage: NA; Package: NA; Distributor_name: DIGIKEY; Distributor_part_number: 36-5002-ND; Library Ref: TESTPOINT; Height: 4.57MM; Weight: NA; Temperature: NA; Datasheet: Y:\MIS_DATABASE\DATASHEETS\MISC\ACCESSORIES\5002.PDF; Crtd /date: MANIRAJA/121216; Chkd/date: VASANTHA/121216; MECHANICAL 3D STEP FILE: TP_CIR67D40_TH_4-6; Footprint Ref: TP_CIR67D40_TH_4-6; Customs_HS_Code: NA; Custom_Duty: NA; Library Path: Y:\MIS_DATABASE\Library\ALTIUM_TOOL\SCHEMATICS_PARTS\MS_DISCRETE_Library.schlib; Footprint Path: Y:\MIS_DATABASE\Library\ALTIUM_TOOL\PCB_FOOTPRINTS\Altium_Footprint_Lib.PcbLib; Manufacturer: KEYSTONE; PCB Footprint: TP_CIR67D40_TH_4-6
TP12 = TESTPOINT_Dup1: TESTPOINT CIR 40 SMD; Part Reference: TP12; Manufacturer: LOCAL; Mfr_part_number: TP234; Mistral Part No: 130009030933; Project: RAINIER-3; Tolerance: NA; Value: TP40_SMD; Chkd/date: MAZHAR/190505; Crtd /date: MAZHAR/190505; Height: NA; Distributor_part_number: NA; Distributor_name: NA; Package: SMD; Part_type: TESTPOINT; Mfr_name: LOCAL; Voltage: NA; Wattage: NA; Weight: NA; Temperature: NA; Datasheet: NA; MECHANICAL 3D STEP FILE: NA; Library Path: Y:\MIS_DATABASE\Library\ALTIUM_TOOL\SCHEMATICS_PARTS\MS_DISCRETE_Library.schlib; Footprint Path: Y:\MIS_DATABASE\Library\ALTIUM_TOOL\PCB_FOOTPRINTS\Altium_Footprint_Lib.PcbLib; Library Ref: TESTPOINT; Footprint Ref: TP40_SMD; RoHS: NA; PCB Footprint: TP40_SMD
TP13 = TESTPOINT: TESTPOINT 1.0MM DRILL PTH; Part Reference: TP13; Mfr_name: LOCAL; Mistral Part No: 130009030938; Project: HSE; Value: THRU HOLE; PCB Footprint: TP_40X65; Chkd/date: MAZHAR/271211; Crtd /date: SHREESHAIL/041005; Height: NA; Distributor_part_number: NA; Distributor_name: NA; Package: THRU-HOLE; Part_type: TESTPOINT; Mfr_part_number: TP_40X65; Datasheet: NA; Library Ref: TESTPOINT; Manufacturer: LOCAL
TP28 = TESTPOINT_Dup1: TESTPOINT CIR 40 SMD; Part Reference: TP28; Manufacturer: LOCAL; Mistral Part No: 130009030933; Project: RAINIER-3; Tolerance: NA; Value: TP40_SMD; Chkd/date: MAZHAR/190505; Crtd /date: MAZHAR/190505; Height: NA; Distributor_part_number: NA; Distributor_name: NA; Package: SMD; Part_type: TESTPOINT; Mfr_part_number: TP40_SMD; Mfr_name: LOCAL; Voltage: NA; Wattage: NA; Weight: NA; Temperature: NA; Datasheet: NA; MECHANICAL 3D STEP FILE: NA; Library Path: Y:\MIS_DATABASE\Library\ALTIUM_TOOL\SCHEMATICS_PARTS\MS_DISCRETE_Library.schlib; Footprint Path: Y:\MIS_DATABASE\Library\ALTIUM_TOOL\PCB_FOOTPRINTS\Altium_Footprint_Lib.PcbLib; Library Ref: TESTPOINT; Footprint Ref: TP40_SMD; RoHS: NA; PCB Footprint: TP40_SMD
TP32 = TESTPOINT_Dup1: TESTPOINT CIR 40 SMD; Part Reference: TP32; Mfr_name: LOCAL; Mistral Part No: 130009030933; Project: RAINIER-3; Tolerance: NA; Value: TP40_SMD; RoHS: NA; Chkd/date: MAZHAR/190505; Crtd /date: MAZHAR/190505; Height: NA; Distributor_part_number: NA; Distributor_name: NA; Package: SMD; Part_type: TESTPOINT; Mfr_part_number: TP40_SMD; Voltage: NA; Wattage: NA; Weight: NA; Temperature: NA; Datasheet: NA; MECHANICAL 3D STEP FILE: NA; Library Path: Y:\MIS_DATABASE\Library\ALTIUM_TOOL\SCHEMATICS_PARTS\MS_DISCRETE_Library.schlib; Footprint Path: Y:\MIS_DATABASE\Library\ALTIUM_TOOL\PCB_FOOTPRINTS\Altium_Footprint_Lib.PcbLib; Library Ref: TESTPOINT; Footprint Ref: TP40_SMD; Manufacturer: LOCAL; PCB Footprint: TP40_SMD
TP33 = TESTPOINT_Dup1: ACCESSORIE PC TEST POINT; Part Reference: TP33; Mistral Part No: 160016120008-R; Mfr_name: KEYSTONE; Part_type: ACCESSORIES; Project: EPOS_EVM; Tolerance: NA; Value: 5002; Mfr_part_number: 5002; Voltage: NA; Wattage: NA; Package: NA; Distributor_name: DIGIKEY; Distributor_part_number: 36-5002-ND; Library Ref: TESTPOINT; Height: 4.57MM; Weight: NA; Temperature: NA; Datasheet: Y:\MIS_DATABASE\DATASHEETS\MISC\ACCESSORIES\5002.PDF; Crtd /date: MANIRAJA/121216; Chkd/date: VASANTHA/121216; MECHANICAL 3D STEP FILE: TP_CIR67D40_TH_4-6; Footprint Ref: TP_CIR67D40_TH_4-6; Customs_HS_Code: NA; Custom_Duty: NA; Library Path: Y:\MIS_DATABASE\Library\ALTIUM_TOOL\SCHEMATICS_PARTS\MS_DISCRETE_Library.schlib; Footprint Path: Y:\MIS_DATABASE\Library\ALTIUM_TOOL\PCB_FOOTPRINTS\Altium_Footprint_Lib.PcbLib; Manufacturer: KEYSTONE; PCB Footprint: TP_CIR67D40_TH_4-6
TP48 = TESTPOINT_Dup1: TESTPOINT CIR 30 SMD; Part Reference: TP48; Mfr_name: LOCAL; Mistral Part No: 130009030930; MECHANICAL 3D STEP FILE: NA; Project: BT MODULE_CSRBC04; Value: TP30_SMD; PCB Footprint: TP30_SMD; Footprint Path: Y:\MIS_DATABASE\Library\ALTIUM_TOOL\PCB_FOOTPRINTS\Altium_Footprint_Lib.PcbLib; Library Path: Y:\MIS_DATABASE\Library\ALTIUM_TOOL\SCHEMATICS_PARTS\MS_DISCRETE_Library.schlib; Custom_Duty: NA; Customs_HS_Code: NA; RoHS: NA; Temperature: NA; Weight: NA; Wattage: NA; Voltage: NA; Tolerance: NA; Footprint Ref: TP30_SMD; Datasheet: NA; Chkd/date: SHREESHAIL/171006; Crtd /date: MAZHAR/171006; Height: NA; Distributor_part_number: NA; Distributor_name: NA; Package: SMD; Part_type: TESTPOINT; Mfr_part_number: TP30_SMD; Library Ref: TESTPOINT
TP55 = TESTPOINT_Dup1: ACCESSORIE PC TEST POINT; Part Reference: TP55; Mistral Part No: 160016120008-R; Mfr_name: KEYSTONE; Part_type: ACCESSORIES; Project: EPOS_EVM; Tolerance: NA; Value: 5002; Mfr_part_number: 5002; Voltage: NA; Wattage: NA; Package: NA; Distributor_name: DIGIKEY; Distributor_part_number: 36-5002-ND; Library Ref: TESTPOINT; Height: 4.57MM; Weight: NA; Temperature: NA; Datasheet: Y:\MIS_DATABASE\DATASHEETS\MISC\ACCESSORIES\5002.PDF; Crtd /date: MANIRAJA/121216; Chkd/date: VASANTHA/121216; MECHANICAL 3D STEP FILE: TP_CIR67D40_TH_4-6; Footprint Ref: TP_CIR67D40_TH_4-6; Customs_HS_Code: NA; Custom_Duty: NA; Library Path: Y:\MIS_DATABASE\Library\ALTIUM_TOOL\SCHEMATICS_PARTS\MS_DISCRETE_Library.schlib; Footprint Path: Y:\MIS_DATABASE\Library\ALTIUM_TOOL\PCB_FOOTPRINTS\Altium_Footprint_Lib.PcbLib; Manufacturer: KEYSTONE; PCB Footprint: TP_CIR67D40_TH_4-6
TP73 = TESTPOINT_Dup1: TESTPOINT CIR 40 SMD; Part Reference: TP73; Mistral Part No: 130009030933; Mfr_name: LOCAL; MECHANICAL 3D STEP FILE: NA; Project: RAINIER-3; Value: TP40_SMD; RoHS: NA; Footprint Ref: TP40_SMD; Library Ref: TESTPOINT; Footprint Path: Y:\MIS_DATABASE\Library\ALTIUM_TOOL\PCB_FOOTPRINTS\Altium_Footprint_Lib.PcbLib; Library Path: Y:\MIS_DATABASE\Library\ALTIUM_TOOL\SCHEMATICS_PARTS\MS_DISCRETE_Library.schlib; Datasheet: NA; Temperature: NA; Weight: NA; Wattage: NA; Voltage: NA; Tolerance: NA; Mfr_part_number: TP40_SMD; Part_type: TESTPOINT; Package: SMD; Distributor_name: NA; Distributor_part_number: NA; Height: NA; Crtd /date: MAZHAR/190505; Chkd/date: MAZHAR/190505; Manufacturer: LOCAL; PCB Footprint: TP40_SMD
TP91 = TESTPOINT_Dup1: TESTPOINT CIR 40 SMD; Part Reference: TP91; Manufacturer: LOCAL; Mistral Part No: 130009030933; Project: RAINIER-3; Tolerance: NA; Value: TP40_SMD; Chkd/date: MAZHAR/190505; Crtd /date: MAZHAR/190505; Height: NA; Distributor_part_number: NA; Distributor_name: NA; Package: SMD; Part_type: TESTPOINT; Mfr_part_number: TP40_SMD; Mfr_name: LOCAL; Voltage: NA; Wattage: NA; Weight: NA; Temperature: NA; Datasheet: NA; MECHANICAL 3D STEP FILE: NA; Library Path: Y:\MIS_DATABASE\Library\ALTIUM_TOOL\SCHEMATICS_PARTS\MS_DISCRETE_Library.schlib; Footprint Path: Y:\MIS_DATABASE\Library\ALTIUM_TOOL\PCB_FOOTPRINTS\Altium_Footprint_Lib.PcbLib; Library Ref: TESTPOINT; Footprint Ref: TP40_SMD; RoHS: NA; PCB Footprint: TP40_SMD
U8 = TPS74801DRCR_SON10: IC 1.5A ADJUSTABLE LDO VOLTAGE REGULATOR WITH PROG SOFT-START VSON10; Part Reference: U8; Manufacturer: TEXAS INSTRUMENTS; Automotive Alternate_mfr_part_number: TPS74801TDRCRQ1; Part_type: ICS\POWER\VOLTAGE REGULATOR; Mistral Part No: 142009030403-R; Custom_Duty: 15%; Customs_HS_Code: 85423100; Wattage: NA; Project: BSN-II; Value: TPS74801DRCR; Automotive Alternate_mfr_name: TEXAS INSTRUMENTS; Footprint Path: Y:\MIS_DATABASE\Library\ALTIUM_TOOL\PCB_FOOTPRINTS\Altium_Footprint_Lib.PcbLib; Library Path: Y:\MIS_DATABASE\Library\ALTIUM_TOOL\SCHEMATICS_PARTS\MS_MISCPOWER_Library.schlib; MECHANICAL 3D STEP FILE: VSON10_TPS74801-Q1_120X120_1; Chkd/date: MANIRAJA/190218; Crtd /date: USMAN/191208; Datasheet: Y:\MIS_DATABASE\DATASHEETS\MISC\REGULATORS\TPS748XX.PDF; Temperature: -40°C+125°C; Weight: 26.1mg; Height: 1.00MM; Library Ref: TPS74801DRCR_SON10; Distributor_part_number: 296-21563-1-ND; Distributor_name: DIGIKEY; Package: VSON10; Voltage: NA; Tolerance: NA; Mfr_part_number: TPS74801DRCR; Mfr_name: TEXAS INSTRUMENTS; Footprint Ref: VSON10_TPS74801-Q1_120X120_1; PCB Footprint: VSON10_TPS74801-Q1_120X120_1
U9 = TPS74801DRCR_SON10: IC 1.5A ADJUSTABLE LDO VOLTAGE REGULATOR WITH PROG SOFT-START VSON10; Part Reference: U9; Mistral Part No: 142009030403-R; Mfr_name: TEXAS INSTRUMENTS; Part_type: ICS\POWER\VOLTAGE REGULATOR; Automotive Alternate_mfr_part_number: TPS74801TDRCRQ1; Project: BSN-II; Tolerance: NA; Customs_HS_Code: 85423100; Custom_Duty: 15%; Value: TPS74801DRCR; Footprint Ref: VSON10_TPS74801-Q1_120X120_1; Mfr_part_number: TPS74801DRCR; Voltage: NA; Wattage: NA; Package: VSON10; Distributor_name: DIGIKEY; Distributor_part_number: 296-21563-1-ND; Library Ref: TPS74801DRCR_SON10; Height: 1.00MM; Weight: 26.1mg; Temperature: -40°C+125°C; Datasheet: Y:\MIS_DATABASE\DATASHEETS\MISC\REGULATORS\TPS748XX.PDF; Crtd /date: USMAN/191208; Chkd/date: MANIRAJA/190218; MECHANICAL 3D STEP FILE: VSON10_TPS74801-Q1_120X120_1; Library Path: Y:\MIS_DATABASE\Library\ALTIUM_TOOL\SCHEMATICS_PARTS\MS_MISCPOWER_Library.schlib; Footprint Path: Y:\MIS_DATABASE\Library\ALTIUM_TOOL\PCB_FOOTPRINTS\Altium_Footprint_Lib.PcbLib; Automotive Alternate_mfr_name: TEXAS INSTRUMENTS; Manufacturer: TEXAS INSTRUMENTS; PCB Footprint: VSON10_TPS74801-Q1_120X120_1
U59 = TPS62177_WSON10: IC 3.3V 0.5A STEP DOWN CONVERTER WITH SLEEP MODE WSON10; Part Reference: U59; Part_type: ICS\POWER\DC-DC CONVERTER; Mfr_name: TEXAS INSTRUMENTS; Mistral Part No: 142019070007-R; Custom_Duty: 15%; Customs_HS_Code: 85423100; Wattage: NA; Project: TI_MAXIE_CPB; Value: TPS62177DQCR; PCB Footprint: WSON10_19-68_80X120_0-8; Footprint Path: Y:\MIS_DATABASE\Library\ALTIUM_TOOL\PCB_FOOTPRINTS\Altium_Footprint_Lib.PcbLib; Library Path: Y:\MIS_DATABASE\Library\ALTIUM_TOOL\SCHEMATICS_PARTS\MS_MISCPOWER_Library.schlib; MECHANICAL 3D STEP FILE: WSON10_19-68_80X120_0-8; Chkd/date: MANIRAJA/170719; Crtd /date: MANIRAJA/170719; Datasheet: Y:\MIS_DATABASE\DATASHEETS\ICS\POWER\TPS62177.PDF; Temperature: -40°C+85°C; Weight: 15mg; Height: 0.80MM; Library Ref: TPS62177_WSON10; Distributor_part_number: 296-41856-1-ND; Distributor_name: DIGIKEY; Package: WSON10; Voltage: NA; Tolerance: NA; Mfr_part_number: TPS62177DQCR; Footprint Ref: WSON10_19-68_80X120_0-8

## Sheet 53. SOC CPU HCPS-A.SchDoc: HCPS A - VDD CPU
size 513 x 386 mm; Project: PROC154E2(001)_SK_AM69; Issue: 1.0; RevCode: E3; Page Create Date: March  8, 1995; Variant Name: Core Design; Schematic Page Number: 53; Page Number: 53; Page Size: C; Comment: MISTRAL_TITLEBLK_CSIZE_1; Page Count: 62; Schematic Page Count: 62; Name: PROC154E2 001 SK AM69; DsnPath: C:\Users\danie\Downloads\sprr466c\PROC154E3_RP\PROC154E3_SCH.DSN; SchematicName: SCHEMATIC1; PageName: 53. SOC CPU HCPS-A; PageSize: C; TopSchematic: True
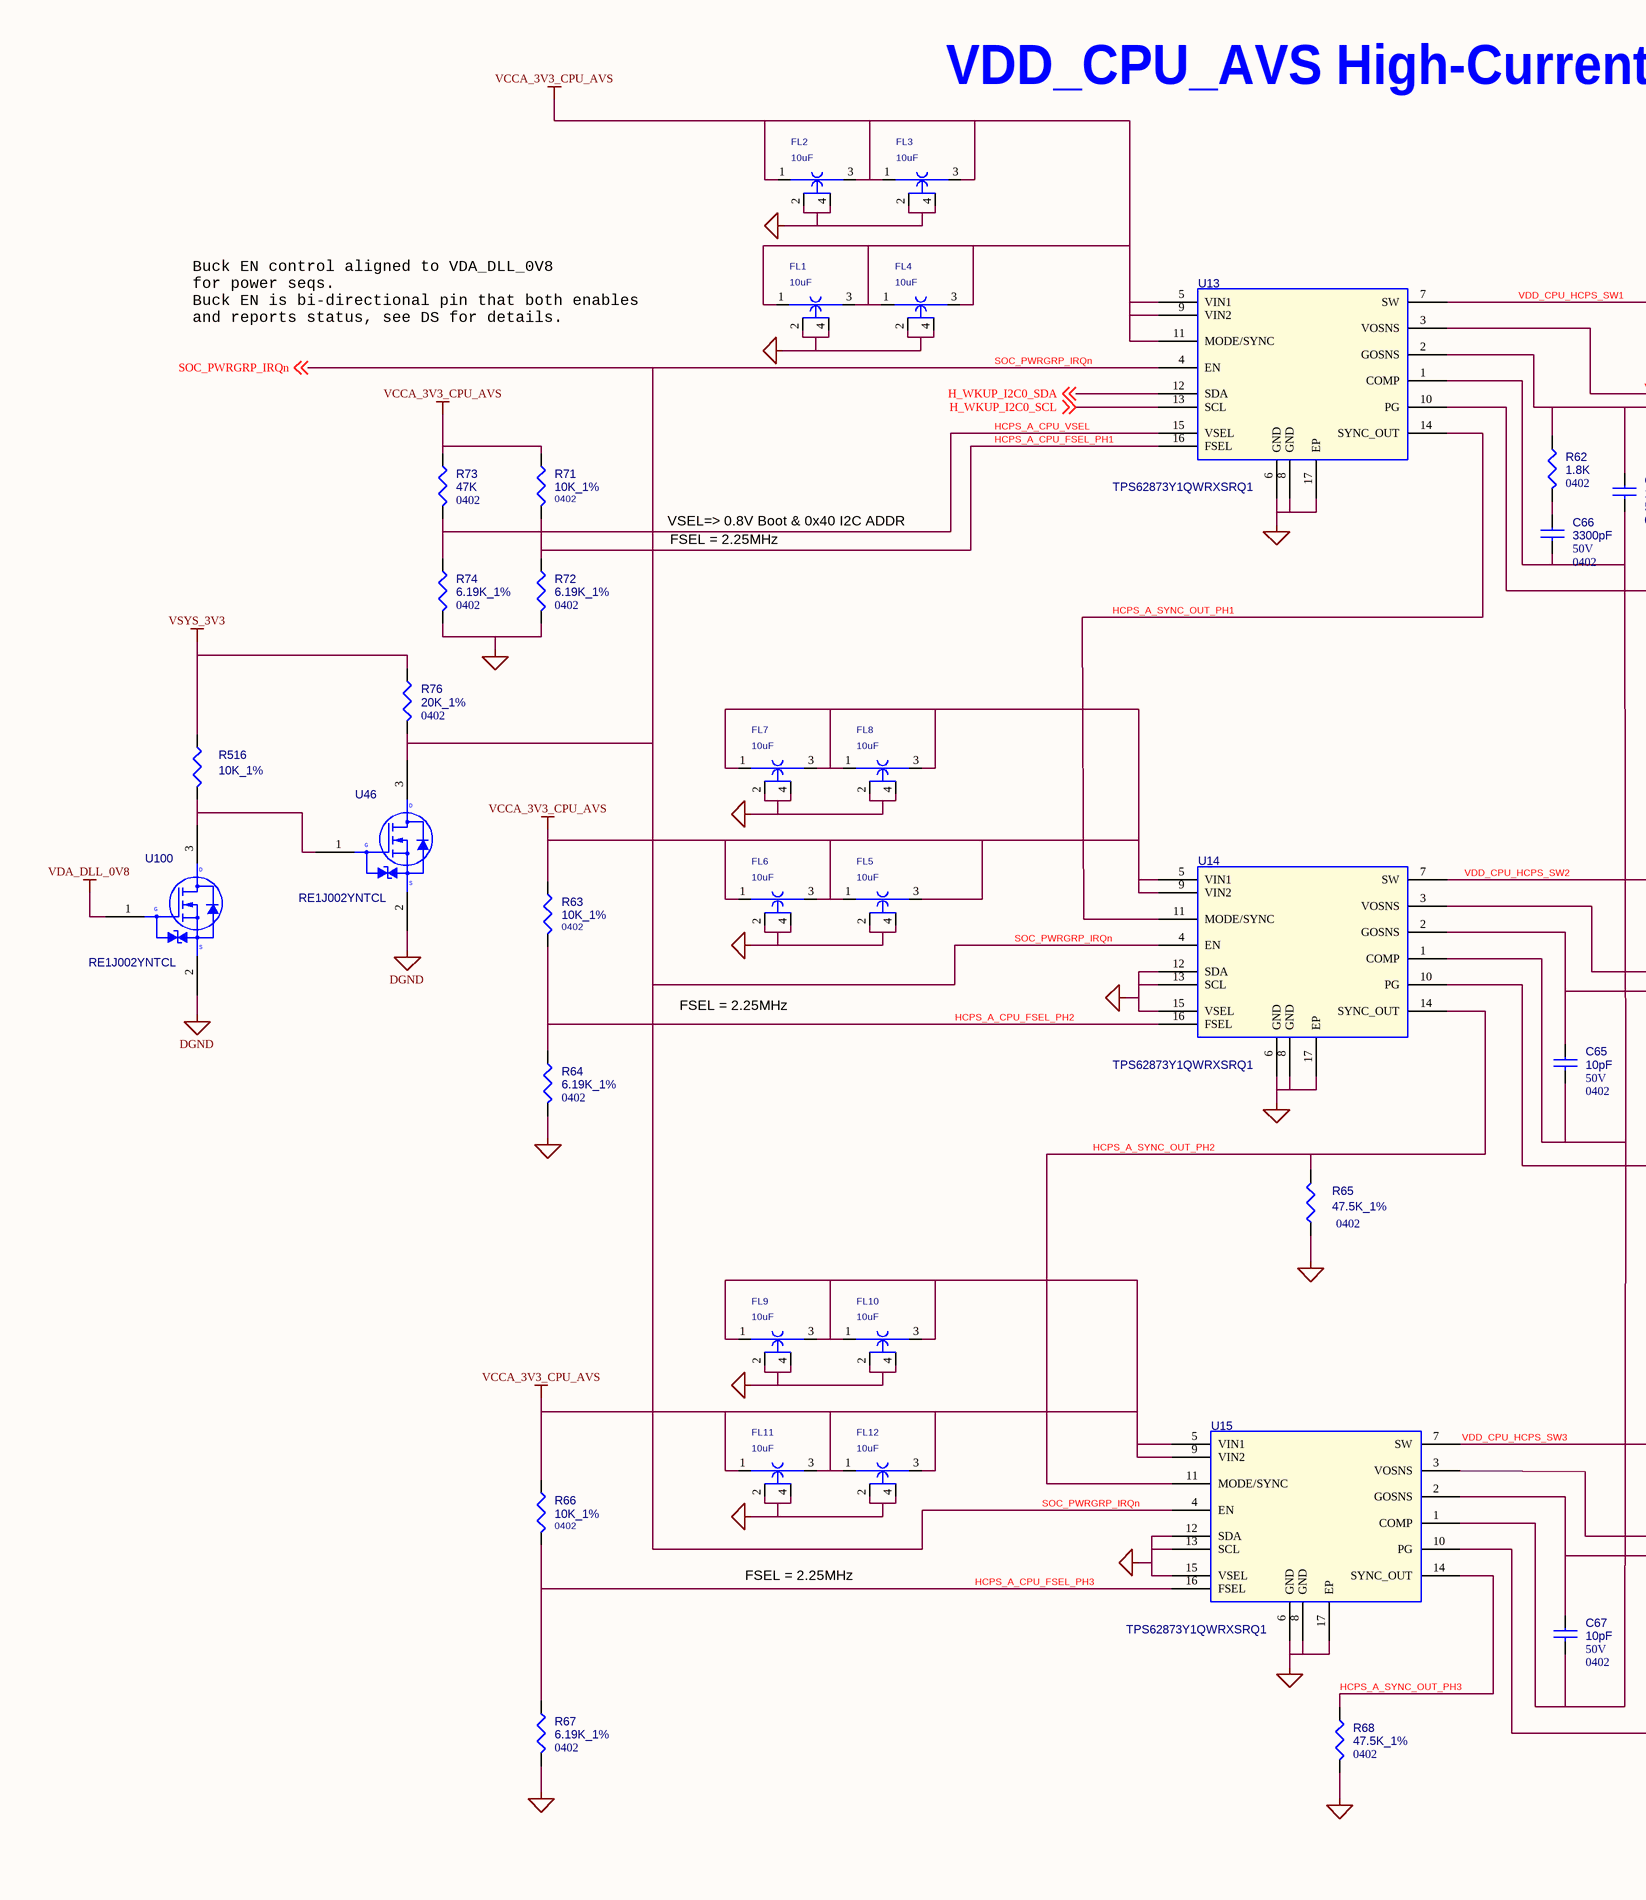
[diagram p89: 53. SOC CPU HCPS-A.SchDoc, left]
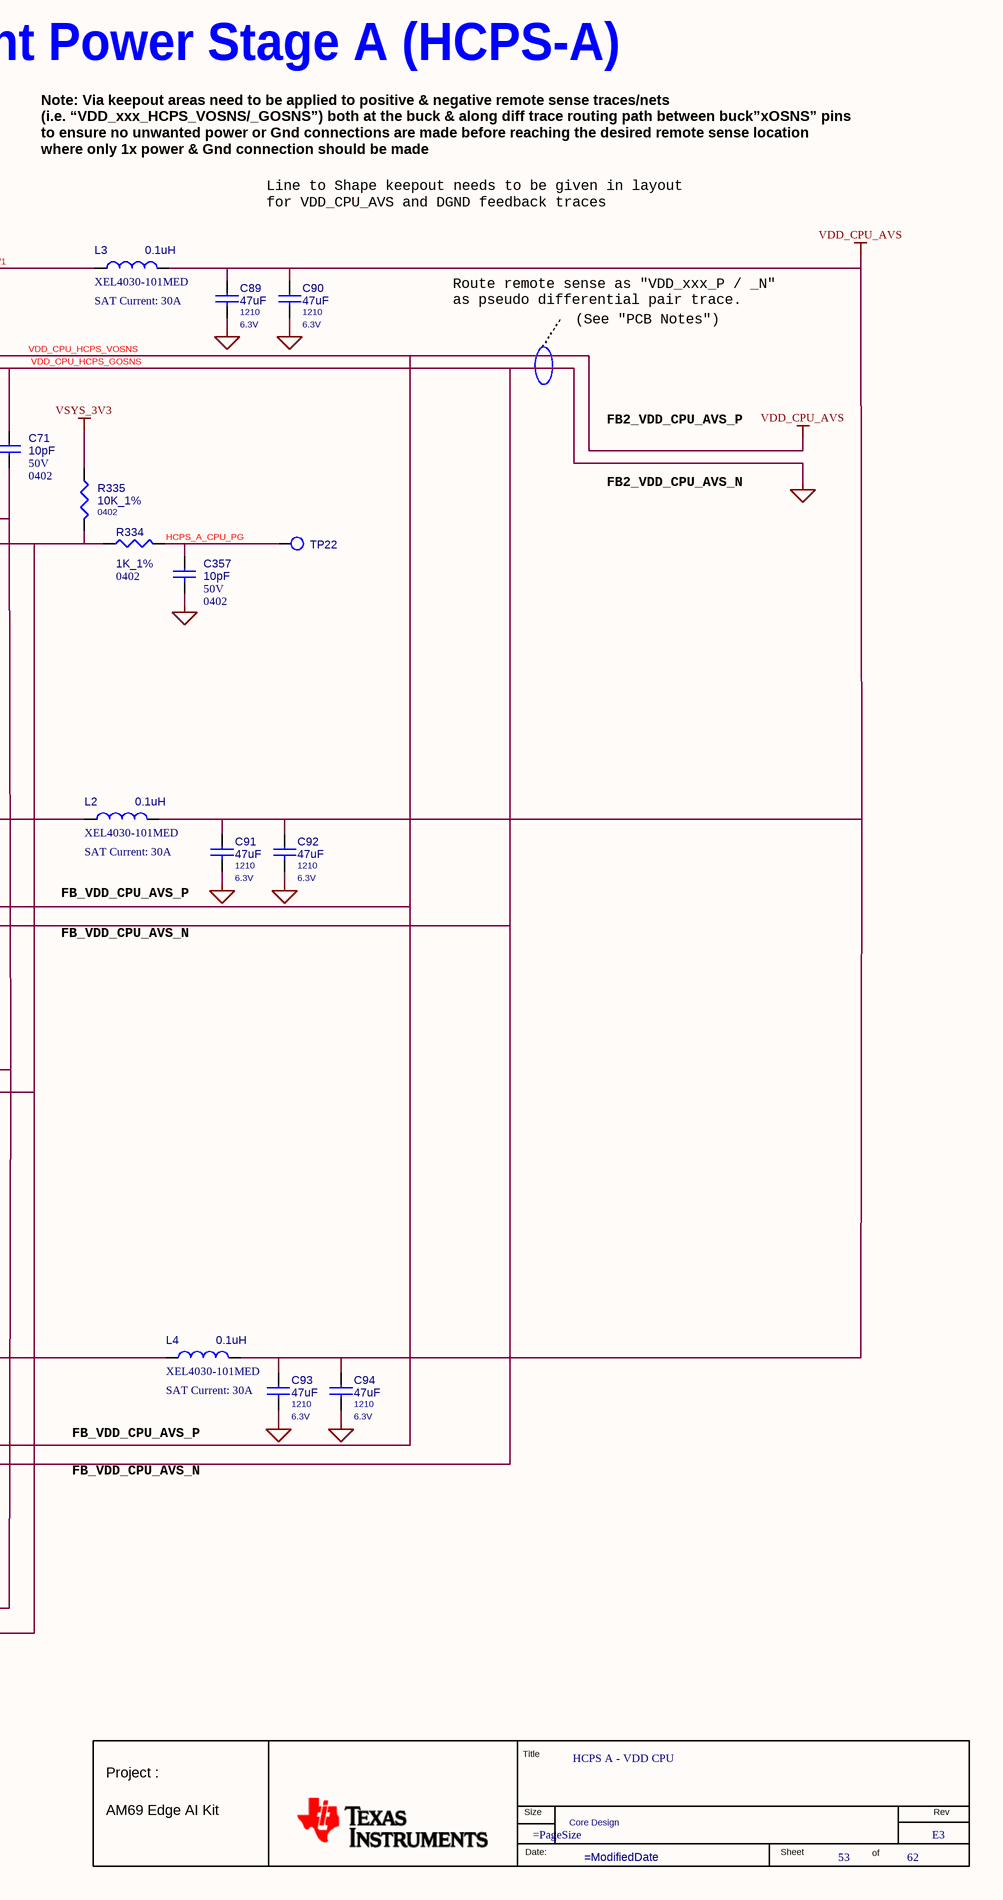
[diagram p90: 53. SOC CPU HCPS-A.SchDoc, right]

### Parts
(Parts that share a designator on the sheet are numbered #1, #2 ... from top to bottom, then left to right.)
*#53  RevCode: E3  Title: HCPS A - VDD CPU  Page Number: 53  Page Count: 62  Variant Name: Core Design  (hidden comment: MISTRAL_TITLEBLK_CSIZE_1)  (graphical)
C65  10pF  Package: 0402  Voltage: 50V  [CAP0402_0-75]
C66  3300pF  Package: 0402  Voltage: 50V  [CAP0402_0-75]
C67  10pF  Voltage: 50V  Package: 0402  [CAP0402_0-75]
C71  10pF  Voltage: 50V  Package: 0402  [CAP0402_0-75]
C89  47uF  Package: 1210  Voltage: 6.3V  [CAP1210_2-75]
C90  47uF  Package: 1210  Voltage: 6.3V  [CAP1210_2-75]
C91  47uF  Package: 1210  Voltage: 6.3V  [CAP1210_2-75]
C92  47uF  Package: 1210  Voltage: 6.3V  [CAP1210_2-75]
C93  47uF  Voltage: 6.3V  Package: 1210  [CAP1210_2-75]
C94  47uF  Voltage: 6.3V  Package: 1210  [CAP1210_2-75]
C357  10pF  Package: 0402  Voltage: 50V  [CAP0402_0-75]
FL1  10uF  [EMIFIL_NFM18C_0603_0-7_TI]
FL2  10uF  [EMIFIL_NFM18C_0603_0-7_TI]
FL3  10uF  [EMIFIL_NFM18C_0603_0-7_TI]
FL4  10uF  [EMIFIL_NFM18C_0603_0-7_TI]
FL5  10uF  [EMIFIL_NFM18C_0603_0-7_TI]
FL6  10uF  [EMIFIL_NFM18C_0603_0-7_TI]
FL7  10uF  [EMIFIL_NFM18C_0603_0-7_TI]
FL8  10uF  [EMIFIL_NFM18C_0603_0-7_TI]
FL9  10uF  [EMIFIL_NFM18C_0603_0-7_TI]
FL10  10uF  [EMIFIL_NFM18C_0603_0-7_TI]
FL11  10uF  [EMIFIL_NFM18C_0603_0-7_TI]
FL12  10uF  [EMIFIL_NFM18C_0603_0-7_TI]
L2  0.1uH  Mfr_part_number: XEL4030-101MED  SAT Current: 30A  [IND_XEL4030_170X170_SMD_3-2]
L3  0.1uH  Mfr_part_number: XEL4030-101MED  SAT Current: 30A  [IND_XEL4030_170X170_SMD_3-2]
L4  0.1uH  SAT Current: 30A  Mfr_part_number: XEL4030-101MED  [IND_XEL4030_170X170_SMD_3-2]
R62  1.8K  Package: 0402  [RES0402_0-5]
R63  10K_1%  Package: 0402  [RES0402_0-5]
R64  6.19K_1%  Package: 0402  [RES0402_0-5]
R65  47.5K_1%  Package: 0402  [RES0402_0-5]
R66  10K_1%  Package: 0402  [RES0402_0-5]
R67  6.19K_1%  Package: 0402  [RES0402_0-5]
R68  47.5K_1%  Package: 0402  [RES0402_0-5]
R71  10K_1%  Package: 0402  [RES0402_0-5]
R72  6.19K_1%  Package: 0402  [RES0402_0-5]
R73  47K  Package: 0402  [RES0402_0-5]
R74  6.19K_1%  Package: 0402  [RES0402_0-5]
R76  20K_1%  Package: 0402  [RES0402_0-5]
R334  1K_1%  Package: 0402  [RES0402_0-5]
R335  10K_1%  Package: 0402  [RES0402_0-5]
R516  10K_1%  [RES0402_0-5]
TP22  TP30_SMD  [TP30_SMD]  (value not drawn)
U13  TPS62873Y1QWRXSRQ1  [VQFN16_TPS62872-Q1_100X140_1-1]
U14  TPS62873Y1QWRXSRQ1  [VQFN16_TPS62872-Q1_100X140_1-1]
U15  TPS62873Y1QWRXSRQ1  [VQFN16_TPS62872-Q1_100X140_1-1]
U46  RE1J002YNTCL  [SOT416F-6_0-9]
U100  RE1J002YNTCL  [SOT416F-6_0-9]

### Nets
VCCA_3V3_CPU_AVS: FL1.1 FL1.3 FL2.1 FL2.3 FL3.1 FL3.3 FL4.1 FL4.3 FL5.1 FL5.3 FL6.1 FL6.3 FL7.1 FL7.3 FL8.1 FL8.3 FL9.1 FL9.3 FL10.1 FL10.3 FL11.1 FL11.3 FL12.1 FL12.3 R63.1 R66.1 R71.1 R73.1 U13.5(VIN1) U13.9(VIN2) U13.11(MODE/SYNC) U14.5(VIN1) U14.9(VIN2) U15.5(VIN1) U15.9(VIN2)
VDA_DLL_0V8: U100.1(G)
VDD_CPU_HCPS_GOSNS: C65.1 C67.1 C71.1 C89.2 C90.2 C91.2 C92.2 C93.2 C94.2 C357.2 FL1.2 FL1.4 FL2.2 FL2.4 FL3.2 FL3.4 FL4.2 FL4.4 FL5.2 FL5.4 FL6.2 FL6.4 FL7.2 FL7.4 FL8.2 FL8.4 FL9.2 FL9.4 FL10.2 FL10.4 FL11.2 FL11.4 FL12.2 FL12.4 R62.1 R64.2 R65.2 R67.2 R68.2 R72.2 R74.2 U13.2(GOSNS) U13.6(GND) U13.8(GND) U13.17(EP) U14.2(GOSNS) U14.6(GND) U14.8(GND) U14.12(SDA) U14.13(SCL) U14.15(VSEL) U14.17(EP) U15.2(GOSNS) U15.6(GND) U15.8(GND) U15.12(SDA) U15.13(SCL) U15.15(VSEL) U15.17(EP) U46.2(S) U100.2(S)  [also labelled DGND]
VDD_CPU_HCPS_VOSNS: C89.1 C90.1 C91.1 C92.1 C93.1 C94.1 L2.2 L3.2 L4.2 U13.3(VOSNS) U14.3(VOSNS) U15.3(VOSNS)  [also labelled VDD_CPU_AVS]
VSYS_3V3: R76.1 R335.1 R516.1  [project net V_3V3]
H_WKUP_I2C0_SCL: U13.13(SCL) ; off-sheet H_WKUP_I2C0_SCL
H_WKUP_I2C0_SDA: U13.12(SDA) ; off-sheet H_WKUP_I2C0_SDA
HCPS_A_CPU_FSEL_PH1: R71.2 R72.1 U13.16(FSEL)
HCPS_A_CPU_FSEL_PH2: R63.2 R64.1 U14.16(FSEL)
HCPS_A_CPU_FSEL_PH3: R66.2 R67.1 U15.16(FSEL)
HCPS_A_CPU_PG: C357.1 R334.2 TP22.1(TP)
HCPS_A_CPU_VSEL: R73.2 R74.1 U13.15(VSEL)
HCPS_A_SYNC_OUT_PH1: U13.14(SYNC_OUT) U14.11(MODE/SYNC)
HCPS_A_SYNC_OUT_PH2: R65.1 U14.14(SYNC_OUT) U15.11(MODE/SYNC)
HCPS_A_SYNC_OUT_PH3: R68.1 U15.14(SYNC_OUT)
SOC_PWRGRP_IRQn: R76.2 U13.4(EN) U14.4(EN) U15.4(EN) U46.3(D) ; off-sheet SOC_PWRGRP_IRQn
VDD_CPU_HCPS_SW1: L3.1 U13.7(SW)
VDD_CPU_HCPS_SW2: L2.1 U14.7(SW)
VDD_CPU_HCPS_SW3: L4.1 U15.7(SW)
NetC65_2: C65.2 C66.2 C67.2 C71.2 U13.1(COMP) U14.1(COMP) U15.1(COMP)
NetC66_1: C66.1 R62.2
NetR334_1: R334.1 R335.2 U13.10(PG) U14.10(PG) U15.10(PG)
NetR516_2: R516.2 U46.1(G) U100.3(D)

### Notes on the sheet
- VDD_CPU_AVS High-Current Power Stage A (HCPS-A)
- Note: Via keepout areas need to be applied to positive & negative remote sense traces/nets
  (i.e. “VDD_xxx_HCPS_VOSNS/_GOSNS”) both at the buck & along diff trace routing path between buck”xOSNS” pins
  to ensure no unwanted power or Gnd connections are made before reaching the desired remote sense location
  where only 1x power & Gnd connection should be made
- Line to Shape keepout needs to be given in layout
  for VDD_CPU_AVS and DGND feedback traces
- Buck EN control aligned to VDA_DLL_0V8
  for power seqs.
  Buck EN is bi-directional pin that both enables
  and reports status, see DS for details.
- Route remote sense as "VDD_xxx_P / _N"
  as pseudo differential pair trace.
- (See "PCB Notes")
- FB2_VDD_CPU_AVS_P
- VSEL=> 0.8V Boot & 0x40 I2C ADDR
- FSEL = 2.25MHz
- FB2_VDD_CPU_AVS_N
- FB_VDD_CPU_AVS_P
- FB_VDD_CPU_AVS_N
- (in symbol MISTRAL_TITLEBLK_CSIZE_1) Title; Project :; Size; Rev; AM69 Edge AI Kit; Date:; Sheet; of